# Altium project Freezer_Power.PrjPcb (part 1 of 2)
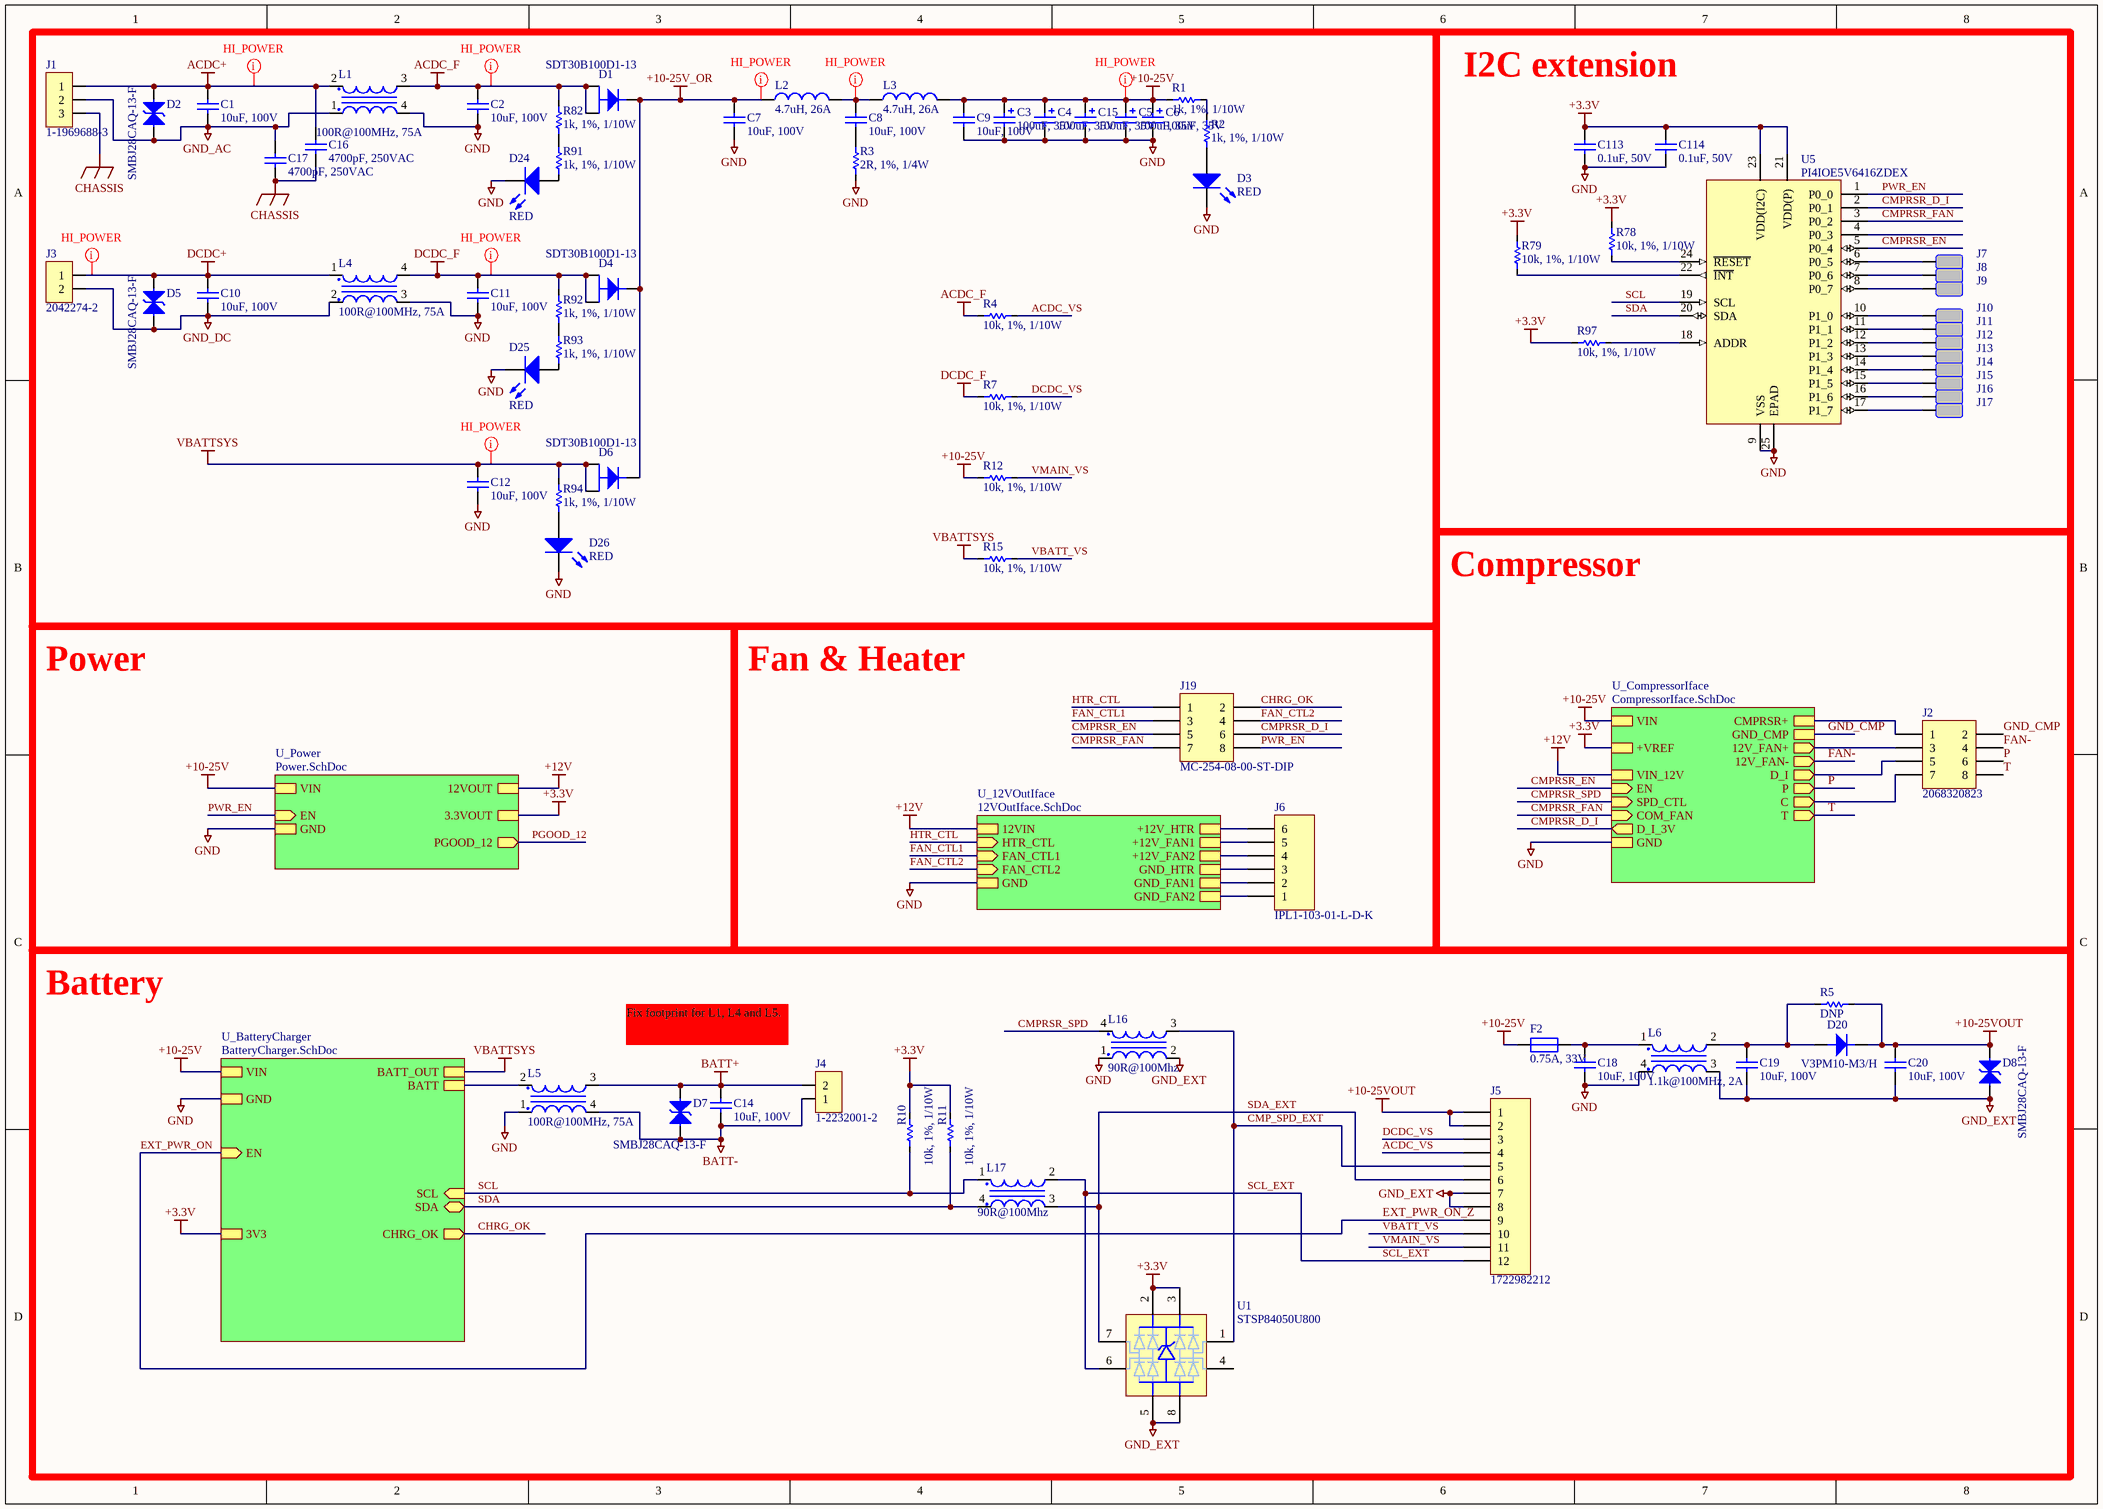
[diagram p0: TopLevel.SchDoc]
BOMRevision: 1.0; ProjectNumber: BIOL-004; ProjectRevision: 1.0; ProjectTitle: Freezer Power
5 sheets, 312 parts. Net scope: hierarchical (ports join the sheet entries above them; power ports are global).
Board file: Freezer_Power.PcbDoc
Sheets:
  TopLevel.SchDoc
    U_BatteryCharger = BatteryCharger.SchDoc
    U_CompressorIface = CompressorIface.SchDoc
    U_Power = Power.SchDoc
    U_12VOutIface = 12VOutIface.SchDoc

## Sheet TopLevel.SchDoc
size A3; SheetNumber: 1; SheetTotal: 5

### Parts
C1  10uF, 100V  [1210]
C2  10uF, 100V  [1210]
C3  100uF, 35V  [CAPAE7866X80L]
C4  100uF, 35V  [CAPAE7866X80L]
C5  100uF, 35V  [CAPAE7866X80L]
C6  100uF, 35V  [CAPAE7866X80L]
C7  10uF, 100V  [1210]
C8  10uF, 100V  [1210]
C9  10uF, 100V  [1210]
C10  10uF, 100V  [1210]
C11  10uF, 100V  [1210]
C12  10uF, 100V  [1210]
C14  10uF, 100V  [1210]
C15  100uF, 35V  [CAPAE7866X80L]
C16  4700pF, 250VAC  [2220-2.5_CAP]
C17  4700pF, 250VAC  [2220-2.5_CAP]
C18  10uF, 100V  [1210]
C19  10uF, 100V  [1210]
C20  10uF, 100V  [1210]
C113  0.1uF, 50V  [0603]
C114  0.1uF, 50V  [0603]
D1  SDT30B100D1-13  [DPAK]
D2  SMBJ28CAQ-13-F  [SMB]
D3  RED  [0603_DIODE_K1A2]
D4  SDT30B100D1-13  [DPAK]
D5  SMBJ28CAQ-13-F  [SMB]
D6  SDT30B100D1-13  [DPAK]
D7  SMBJ28CAQ-13-F  [SMB]
D8  SMBJ28CAQ-13-F  [SMB]
D20  V3PM10-M3/H  [SMP]
D24  RED  [0603_DIODE_K1A2]
D25  RED  [0603_DIODE_K1A2]
D26  RED  [0603_DIODE_K1A2]
F2  0.75A, 33V  [1812_CAP]
J1  1-1969688-3  [CONN_TE_1-1969688-3]
J2  2068320823  [CONN_206832-0823]
J3  2042274-2  [CONN_TE_2042274-2]
J4  1-2232001-2  [CONN_TE_1-2232001-2]
J5  1722982212  [CONN_MOLEX_1722982212]
J6  IPL1-103-01-L-D-K  [CONN_SAMTEC_IPL1-103-XX-X-D]
J7  1.5x3.5  [PAD_15_35]  (value not drawn)  (no BOM)
J8  1.5x3.5  [PAD_15_35]  (value not drawn)  (no BOM)
J9  1.5x3.5  [PAD_15_35]  (value not drawn)  (no BOM)
J10  1.5x3.5  [PAD_15_35]  (value not drawn)  (no BOM)
J11  1.5x3.5  [PAD_15_35]  (value not drawn)  (no BOM)
J12  1.5x3.5  [PAD_15_35]  (value not drawn)  (no BOM)
J13  1.5x3.5  [PAD_15_35]  (value not drawn)  (no BOM)
J14  1.5x3.5  [PAD_15_35]  (value not drawn)  (no BOM)
J15  1.5x3.5  [PAD_15_35]  (value not drawn)  (no BOM)
J16  1.5x3.5  [PAD_15_35]  (value not drawn)  (no BOM)
J17  1.5x3.5  [PAD_15_35]  (value not drawn)  (no BOM)
J19  MC-254-08-00-ST-DIP  [CONN_206832]
L1  100R@100MHz, 75A  [FIL_CM5441Z101B-10]
L2  4.7uH, 26A  [INDM178169X70N]
L3  4.7uH, 26A  [INDM178169X70N]
L4  100R@100MHz, 75A  [FIL_CM5441Z101B-10]
L5  100R@100MHz, 75A  [FIL_CM5441Z101B-10]
L6  1.1k@100MHz, 2A  [PLCC440P435X370X235-4L]
L16  90R@100Mhz  [BOURNS_SRF2012]
L17  90R@100Mhz  [BOURNS_SRF2012]
R1  1k, 1%, 1/10W  [0603]
R2  1k, 1%, 1/10W  [0603]
R3  2R, 1%, 1/4W  [1206]
R4  10k, 1%, 1/10W  [0603]
R5  DNP  [0805]
R7  10k, 1%, 1/10W  [0603]
R10  10k, 1%, 1/10W  [0603]
R11  10k, 1%, 1/10W  [0603]
R12  10k, 1%, 1/10W  [0603]
R15  10k, 1%, 1/10W  [0603]
R78  10k, 1%, 1/10W  [0603]
R79  10k, 1%, 1/10W  [0603]
R82  1k, 1%, 1/10W  [0603]
R91  1k, 1%, 1/10W  [0603]
R92  1k, 1%, 1/10W  [0603]
R93  1k, 1%, 1/10W  [0603]
R94  1k, 1%, 1/10W  [0603]
R97  10k, 1%, 1/10W  [0603]
U1  STSP84050U800  [SOIC127P600X163-8N]
U5  PI4IOE5V6416ZDEX  [QFN50P400X400X90_HS-25L]

### Blocks framed on the sheet
I2C extension: C113 C114 J7-J17 R78 R79 R97 U5
Compressor: J2
Fan & Heater: J6 J19
Battery: C14 C18-C20 D7 D8 D20 F2 J4 J5 L5 L6 L16 L17 R5 R10 R11 U1

### Sub-sheets
U_12VOutIface = 12VOutIface.SchDoc: 12VIN, GND, HTR_CTL (in), FAN_CTL1 (in), FAN_CTL2 (in), +12V_FAN1, +12V_FAN2, +12V_HTR, GND_HTR, GND_FAN2, GND_FAN1
U_BatteryCharger = BatteryCharger.SchDoc: VIN, GND, EN (in), BATT_OUT, BATT, CHRG_OK (out), SCL (in), SDA (bidir), 3V3
U_CompressorIface = CompressorIface.SchDoc: VIN, EN (in), GND, SPD_CTL (in), D_I_3V (out), COM_FAN (in), +VREF, CMPRSR+, 12V_FAN+ (out), 12V_FAN- (out), D_I (out), C (out), P (out), T (out), GND_CMP, VIN_12V
U_Power = Power.SchDoc: EN (in), VIN, GND, 12VOUT, PGOOD_12 (out), 3.3VOUT

### Nets
12V_FAN+: J2.3 ; sheet U_CompressorIface/12V_FAN+
+3.3V: C113.1 C114.1 R10.1 R11.1 R78.1 R79.1 R97.1 U1.2 U1.3 U5.21(VDD(P)) U5.23(VDD(I2C)) ; sheet U_BatteryCharger/3V3, sheet U_CompressorIface/+VREF, sheet U_Power/3.3VOUT
+10-25V: C3.1 C4.1 C5.1 C6.1 C9.2 C15.1 F2.2(K) L3.2 R1.2 R12.2 ; sheet U_BatteryCharger/VIN, sheet U_CompressorIface/VIN, sheet U_Power/VIN
+10-25V_OR: C7.2 D1.2(K) D4.2(K) D6.2(K) L2.1
+10-25VOUT: C20.2 D8.2(K) D20.2(K) J5.1 J5.2 R5.2
+12V: sheet U_CompressorIface/VIN_12V, sheet U_Power/12VOUT, sheet U_12VOutIface/12VIN
+12V_FAN1: J6.5 ; sheet U_12VOutIface/+12V_FAN1
+12V_FAN2: J6.4 ; sheet U_12VOutIface/+12V_FAN2
+12V_HTR: J6.6 ; sheet U_12VOutIface/+12V_HTR
ACDC+: C1.2 C16.2 D2.2(K) J1.1 L1.2
ACDC_F: C2.2 D1.1(A) D1.3(A) L1.3 R4.2 R82.1
BATT+: C14.2 D7.2(K) J4.2 L5.3
BATT-: C14.1 D7.1(A) J4.1 L5.4
CHASSIS: C16.1 C17.1 J1.3
CMPRSR+: J2.1 ; sheet U_CompressorIface/CMPRSR+
DCDC+: C10.2 D5.2(K) J3.1 L4.1
DCDC_F: C11.2 D4.1(A) D4.3(A) L4.4 R7.2 R92.1
FAN-: J2.4 ; sheet U_CompressorIface/12V_FAN-  [project net 12V_FAN-]
GND: C2.1 C3.2 C4.2 C5.2 C6.2 C7.1 C9.1 C11.1 C12.1 C15.2 C18.1 C113.2 C114.2 D3.2(K) D24.2(K) D25.2(K) D26.2(K) L1.4 L4.3 L5.1 L6.4 L16.1 R3.1 U5.9(VSS) U5.25(EPAD) ; sheet U_BatteryCharger/GND, sheet U_CompressorIface/GND, sheet U_Power/GND, sheet U_12VOutIface/GND
GND_AC: C1.1 C17.2 D2.1(A) J1.2 L1.1
GND_CMP: J2.2 ; sheet U_CompressorIface/GND_CMP
GND_DC: C10.1 D5.1(A) J3.2 L4.2
GND_EXT: C19.1 C20.1 D8.1(A) J5.7 J5.8 L6.3 L16.2 U1.5 U1.8
GND_FAN1: J6.2 ; sheet U_12VOutIface/GND_FAN1
GND_FAN2: J6.1 ; sheet U_12VOutIface/GND_FAN2
GND_HTR: J6.3 ; sheet U_12VOutIface/GND_HTR
SR1_N: L5.2 ; sheet U_BatteryCharger/BATT
VBATTSYS: C12.2 D6.1(A) D6.3(A) R15.2 R94.1 ; sheet U_BatteryCharger/BATT_OUT  [project net SR1_P]
ACDC_VS: J5.4 R4.1
C: J2.7 ; sheet U_CompressorIface/C
CHRG_OK: J19.2 ; sheet U_BatteryCharger/CHRG_OK
CMP_SPD_EXT: J5.5 L16.3 U1.1
CMPRSR_D_I: J19.6 U5.2(P0_1) ; sheet U_CompressorIface/D_I_3V
CMPRSR_EN: J19.5 U5.5(P0_4) ; sheet U_CompressorIface/EN
CMPRSR_FAN: J19.7 U5.3(P0_2) ; sheet U_CompressorIface/COM_FAN
CMPRSR_SPD: L16.4 ; sheet U_CompressorIface/SPD_CTL
D_I: J2.5 ; sheet U_CompressorIface/D_I
DCDC_VS: J5.3 R7.1
EXT_PWR_ON: J5.9 ; sheet U_BatteryCharger/EN  [also labelled EXT_PWR_ON_Z]
FAN_CTL1: J19.3 ; sheet U_12VOutIface/FAN_CTL1
FAN_CTL2: J19.4 ; sheet U_12VOutIface/FAN_CTL2
HTR_CTL: J19.1 ; sheet U_12VOutIface/HTR_CTL
P: J2.6 ; sheet U_CompressorIface/P
PWR_EN: J19.8 U5.1(P0_0) ; sheet U_Power/EN  [project net EN]
SCL: L17.1 R10.2 U5.19(SCL) ; sheet U_BatteryCharger/SCL
SCL_EXT: J5.12 L17.2 U1.6
SDA: L17.4 R11.2 U5.20(SDA) ; sheet U_BatteryCharger/SDA
SDA_EXT: J5.6 L17.3 U1.7
T: J2.8 ; sheet U_CompressorIface/T
VBATT_VS: J5.10 R15.1
VMAIN_VS: J5.11 R12.1
NetC8_1: C8.1 R3.2
NetC8_2: C8.2 L2.2 L3.1
NetC18_2: C18.2 F2.1(A) L6.1
NetC19_2: C19.2 D20.1(A) L6.2 R5.1
NetD3_1: D3.1(A) R2.2
NetD24_1: D24.1(A) R91.2
NetD25_1: D25.1(A) R93.2
NetD26_1: D26.1(A) R94.2
NetJ7_1: J7.1 U5.6(P0_5)
NetJ8_1: J8.1 U5.7(P0_6)
NetJ9_1: J9.1 U5.8(P0_7)
NetJ10_1: J10.1 U5.10(P1_0)
NetJ11_1: J11.1 U5.11(P1_1)
NetJ12_1: J12.1 U5.12(P1_2)
NetJ13_1: J13.1 U5.13(P1_3)
NetJ14_1: J14.1 U5.14(P1_4)
NetJ15_1: J15.1 U5.15(P1_5)
NetJ16_1: J16.1 U5.16(P1_6)
NetJ17_1: J17.1 U5.17(P1_7)
NetR1_1: R1.1 R2.1
NetR78_2: R78.2 U5.24(~{RESET})
NetR79_2: R79.2 U5.22(~{INT})
NetR82_2: R82.2 R91.1
NetR92_2: R92.2 R93.1
NetR97_2: R97.2 U5.18(ADDR)

Not connected (* = marked no-connect by the designer): U1 4; U5 4(P0_3)

### Layout directives
net class HI_POWER: +10-25V, +10-25V_OR, ACDC+, ACDC_F, DCDC+, DCDC_F, NetC8_2, SR1_P

### Notes on the sheet
- Power
- Fix footprint for L1, L4 and L5.

### Library data of the parts
C1 C2 C7-C12 C14 C18-C20 = NS00779: MLCC 10UF 100V X7S 1210; Type: C; Alternatives: Generic; Part Number: NS00779; Value: 10uF, 100V; Supplier 1: Digi-Key; Supplier Part Number 1: 1276-CL32Y106KCVZNWECT-ND
C3-C6 C15 = NS00911: CAP ALUM 100UF 20% 35V SMD; Type: C; Alternatives: Generic; Part Number: NS00911; Value: 100uF, 35V; Supplier 1: Digi-Key; Supplier Part Number 1: PCE5051CT-ND
C16 C17 = NS00768: CAP CER 4700PF 250VAC X7R 2220; Type: C; Alternatives: Generic; Part Number: NS00768; Value: 4700pF, 250VAC; Supplier 1: Digi-Key; Supplier Part Number 1: 2873-SCC2220X472K502TGCT-ND
C113 C114 = NS00838: CAP CER 0.1UF 50V X7R 0603; Type: C; Alternatives: Generic; Part Number: NS00838; Value: 0.1uF, 50V; Supplier 1: Digi-Key; Supplier Part Number 1: 1276-1935-1-ND
D1 D4 D6 = NS00785: DIODE SCHOTTKY 100V 30A TO252; Part Number: NS00785; Type: Diode; Value: SDT30B100D1-13; ComponentLink1Description: Datasheet; ComponentLink1URL: H:\Doc\Diodes\SDT30B100D1.pdf; Supplier 1: Digi-Key; Supplier Part Number 1: SDT30B100D1-13DICT-ND
D2 D5 D7 D8 = NS00890: TVS DIODE 28VWM 45.4VC SMB; Part Number: NS00890; Type: Diode; Value: SMBJ28CAQ-13-F; ComponentLink1Description: Datasheet; ComponentLink1URL: H:\Doc\Diodes\SMBJ6.5CAQ-SMBJ100CAQ.pdf; Supplier 1: Digi-Key; Supplier Part Number 1: SMBJ28CAQ-13-FDICT-ND
D3 D24-D26 = NS00945: LED RED CLEAR 1608 SMD; Type: IC; Part Number: NS00945; Value: RED; ComponentLink1Description: Datasheet; ComponentLink1URL: H:\Doc\Harvatek\B1911USD-20D000114U1930.pdf; Supplier 1: Digi-Key; Supplier Part Number 1: 3147-B1911USD-20D000114U1930CT-ND
D20 = NS00857: SCHOTTKY RECTIFIER 3A 100V SMP; Part Number: NS00857; Type: Diode; Value: V3PM10-M3/H; ComponentLink1Description: Datasheet; ComponentLink1URL: H:\Doc\Vishay\v3pm10.pdf; Supplier 1: Digi-Key; Supplier Part Number 1: 112-V3PM10-M3/HCT-ND
F2 = NS00949: PTC RESET FUSE 33V 750MA 1812; Alternatives: Generic; Part Number: NS00949; Type: Fuse; Value: 0.75A, 33V; Supplier 1: Digi-Key; Supplier Part Number 1: 283-3153-1-ND
J1 = NS00900: CONN HEADER VERT 3POS 6MM; Part Number: NS00900; Type: Connector; Value: 1-1969688-3; ComponentLink1Description: Product Spec; ComponentLink1URL: H:\Doc\Tyco\ENG_SS_108-32090_E.pdf; ComponentLink2Description: Application Spec; ComponentLink2URL: H:\Doc\Tyco\ENG_SS_114-32136_D.pdf; ComponentLink3Description: Drawing; ComponentLink3URL: H:\Doc\Tyco\ENG_CD_1969688_C.pdf; Supplier 1: Digi-Key; Supplier Part Number 1: A120938-ND
J2 = Header 4X2: Connector Header Through Hole 8 position 0.118" (3.00mm); LatestRevisionDate: 17-Jul-2002; LatestRevisionNote: Re-released for DXP Platform.; Publisher: Altium Limited; Supplier 1: Digi-Key; Supplier Part Number 1: WM10684-ND
J3 = NS00791: CONN HEADER 2POS PCB; Part Number: NS00791; Type: Connector; Value: 2042274-2; ComponentLink1Description: Datasheet; ComponentLink1URL: H:\Doc\Tyco\ENG_SS_108-19346_H1.pdf; ComponentLink2Description: Drawing; ComponentLink2URL: H:\Doc\Tyco\ENG_CD_2042274_D.pdf; ComponentLink3Description: Application Specification; ComponentLink3URL: H:\Doc\Tyco\ENG_SS_114-19110_C.pdf; Supplier 1: Digi-Key; Supplier Part Number 1: A105511CT-ND
J4 = NS00788: CONN HEADER VERT 2POS 5MM; Part Number: NS00788; Type: Connector; Value: 1-2232001-2; ComponentLink1Description: Datasheet; ComponentLink1URL: H:\Doc\Tyco\ENG_CD_1971845_B1.pdf; Supplier 1: Digi-Key; Supplier Part Number 1: A117216-ND
J5 = NS00894: CONN HEADER VERT 12POS 3.5MM; Part Number: NS00894; Type: Connector; Value: 1722982212; ComponentLink1Description: Datasheet; ComponentLink1URL: H:\Doc\Molex\1722982212_PCB_HEADERS.pdf; ComponentLink2Description: Application Specification; ComponentLink2URL: H:\Doc\Molex\AS-172323-0001-001.pdf; ComponentLink3Description: Drawing; ComponentLink3URL: H:\Doc\Molex\1722982212_sd.pdf; Supplier 1: Digi-Key; Supplier Part Number 1: WM11767-ND
J6 = NS00897: CONN HEADER VERT 6POS 2.54MM; Part Number: NS00897; Type: Connector; Value: IPL1-103-01-L-D-K; ComponentLink1Description: Datasheet; ComponentLink1URL: H:\Doc\Samtec\100_mini_mate.pdf; ComponentLink2Description: Dimensions; ComponentLink2URL: H:\Doc\Samtec\ipl1.pdf; Supplier 1: Digi-Key; Supplier Part Number 1: SAM9594-ND
J7-J17 = NS00465: PAD SOLDER 1.5x3.5MM; Part Number: NS00465; Type: Mechanical; Value: 1.5x3.5
J19 = Header 4X2: Header, 4-Pin, Dual row; LatestRevisionDate: 17-Jul-2002; LatestRevisionNote: Re-released for DXP Platform.; Publisher: Altium Limited; Supplier 1: Farnell; Supplier Part Number 1: MC-254-08-00-ST-DIP
L1 L4 L5 = NS00942: CMC 75A 2LN 100 OHM TH; Type: Inductor; Part Number: NS00942; Value: 100R@100MHz, 75A; ComponentLink1Description: Datasheet; ComponentLink1URL: H:\Doc\Laird\cm5441z101b-10-datasheet.pdf; Supplier 1: Digi-Key; Supplier Part Number 1: 240-2489-ND
L2 L3 = NS00854: FIXED IND 4.7UH 26A 5.5 MOHM SMD; Part Number: NS00854; Type: Inductor; Value: 4.7uH, 26A; ComponentLink1Description: Datasheet; ComponentLink1URL: H:\Doc\Bourns\srp1770c.pdf; Supplier 1: Digi-Key; Supplier Part Number 1: SRP1770C-4R7MCT-ND
L6 = CHOKE_COMMON_ALT: CMC 2A 2LN 1.1K OHM SMD; Part Number: NS00952; Type: Inductor; Value: 1.1k@100MHz, 2A; ComponentLink1Description: Datasheet; ComponentLink1URL: H:\Doc\Murata\EFLC0026.pdf; Supplier 1: Digi-Key; Supplier Part Number 1: 490-12641-1-ND
L16 L17 = NS00042: INDUCTOR COMMON MODE 90 OHM 25%; Part Number: NS00042; Type: Inductor; Value: 90R@100Mhz; ComponentLink1Description: Datasheet; ComponentLink1URL: H:\Doc\Bourns\SRF2012A.pdf; Supplier 1: Digi-Key; Supplier Part Number 1: SRF2012-900YATR-ND
R1 R2 R82 R91-R94 = NS00882: RES 1K OHM 1% 1/10W 0603; Alternatives: Generic; Part Number: NS00882; Type: R; Value: 1k, 1%, 1/10W; Supplier 1: Digi-Key; Supplier Part Number 1: RMCF0603FT1K00CT-ND
R3 = NS00946: RES 2 OHM 1% 1/4W 1206; Alternatives: Generic; Part Number: NS00946; Type: R; Value: 2R, 1%, 1/4W; Supplier 1: Digi-Key; Supplier Part Number 1: 738-RMCF1206FT2R00CT-ND
R4 R7 R10-R12 R15 R78 R79 R97 = NS00820: RES 10K OHM 1% 1/10W 0603; Alternatives: Generic; Part Number: NS00820; Type: R; Value: 10k, 1%, 1/10W; Supplier 1: Digi-Key; Supplier Part Number 1: RMCF0603FT10K0CT-ND
R5 = NS00258: RES SMD 0.0 OHM JUMPER 1/2W 0805; Value: 0R; Part Number: NS00258; Type: R; Supplier 1: Digi-Key; Supplier Part Number 1: 36-5106CT-ND
U1 = NS00913: TVS DIODE 5VWM 20VC 8-SOP; Part Number: NS00913; Type: IC; Value: STSP84050U800; ComponentLink1Description: Datasheet; ComponentLink1URL: H:\Doc\Eaton\eaton-stsp84xxxxxx-tvs-diode-array-esd-suppressor-data-sheet.pdf; Supplier 1: Digi-Key; Supplier Part Number 1: 283-STSP84050U800CT-ND
U5 = NS00947: IC XPNDR 400KHZ I2C 24TQFN; Part Number: NS00947; Type: IC; Value: PI4IOE5V6416ZDEX; ComponentLink1Description: Datasheet; ComponentLink1URL: H:\Doc\Diodes\PI4IOE5V6416.pdf; Supplier 1: Digi-Key; Supplier Part Number 1: PI4IOE5V6416ZDEXDICT-ND

## Sheet BatteryCharger.SchDoc
size A3; SheetNumber: 2; SheetTotal: 5
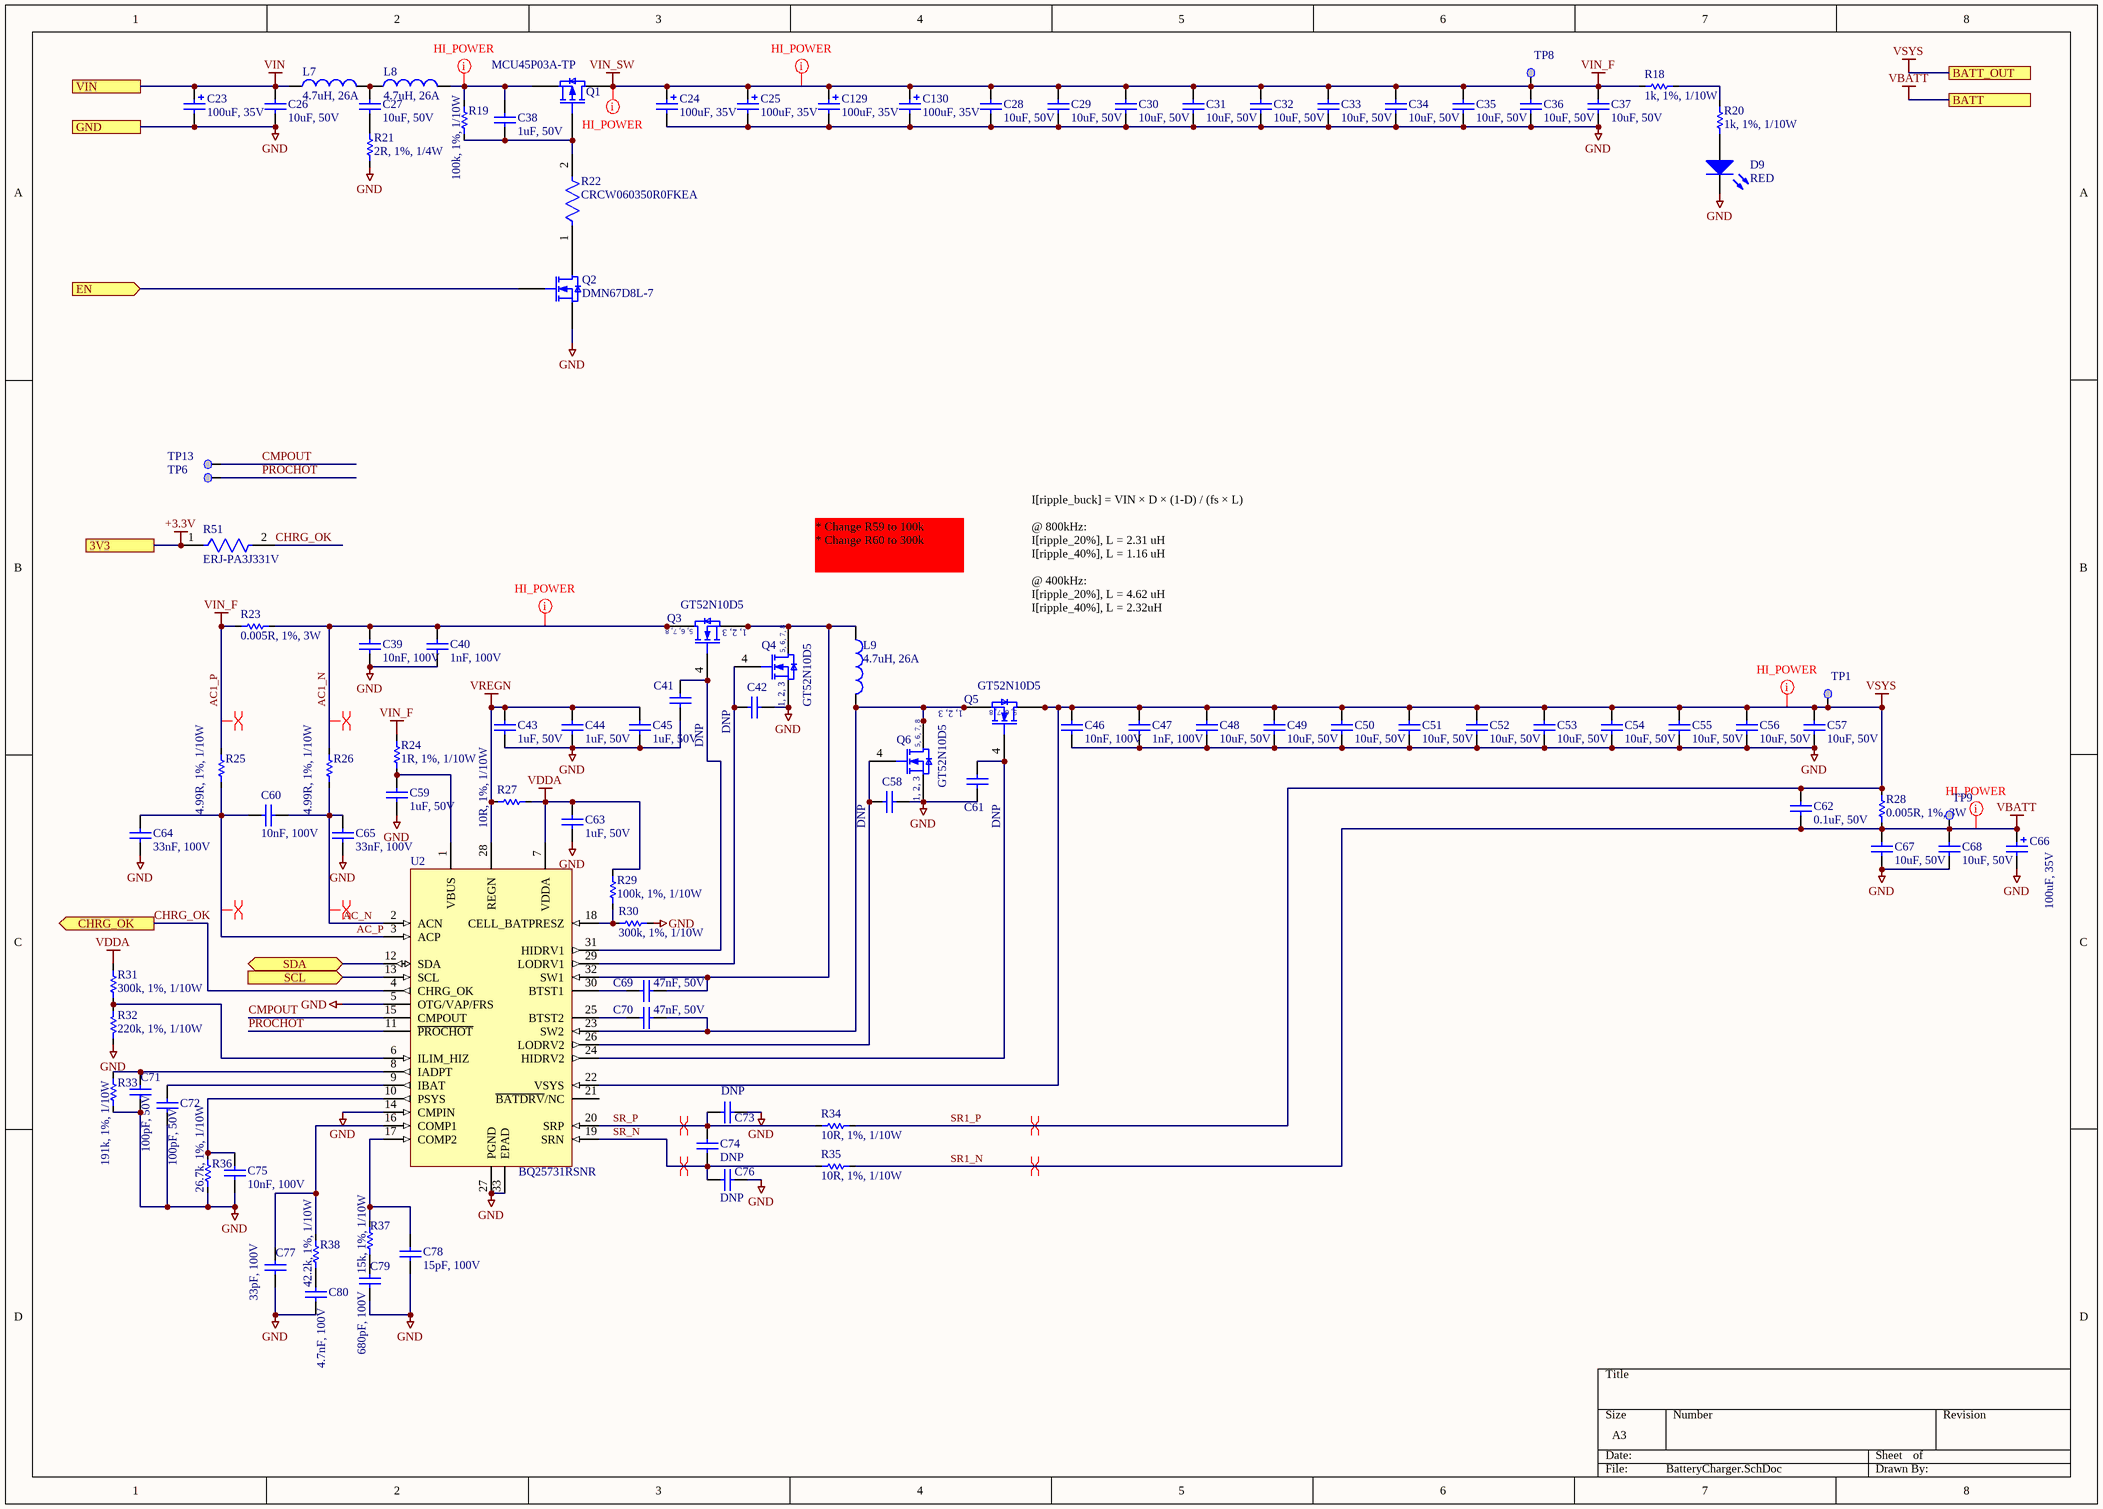
[diagram p1: BatteryCharger.SchDoc]

### Parts
C23  100uF, 35V  [CAPAE7866X80L]
C24  100uF, 35V  [CAPAE7866X80L]
C25  100uF, 35V  [CAPAE7866X80L]
C26  10uF, 50V  [1206]
C27  10uF, 50V  [1206]
C28  10uF, 50V  [1206]
C29  10uF, 50V  [1206]
C30  10uF, 50V  [1206]
C31  10uF, 50V  [1206]
C32  10uF, 50V  [1206]
C33  10uF, 50V  [1206]
C34  10uF, 50V  [1206]
C35  10uF, 50V  [1206]
C36  10uF, 50V  [1206]
C37  10uF, 50V  [1206]
C38  1uF, 50V  [0805]
C39  10nF, 100V  [0603]
C40  1nF, 100V  [0603]
C41  DNP  [0603]
C42  DNP  [0603]
C43  1uF, 50V  [0805]
C44  1uF, 50V  [0805]
C45  1uF, 50V  [0805]
C46  10nF, 100V  [0603]
C47  1nF, 100V  [0603]
C48  10uF, 50V  [1206]
C49  10uF, 50V  [1206]
C50  10uF, 50V  [1206]
C51  10uF, 50V  [1206]
C52  10uF, 50V  [1206]
C53  10uF, 50V  [1206]
C54  10uF, 50V  [1206]
C55  10uF, 50V  [1206]
C56  10uF, 50V  [1206]
C57  10uF, 50V  [1206]
C58  DNP  [0603]
C59  1uF, 50V  [0805]
C60  10nF, 100V  [0603]
C61  DNP  [0603]
C62  0.1uF, 50V  [0603]
C63  1uF, 50V  [0805]
C64  33nF, 100V  [0805_CAP]
C65  33nF, 100V  [0805_CAP]
C66  100uF, 35V  [CAPAE7866X80L]
C67  10uF, 50V  [1206]
C68  10uF, 50V  [1206]
C69  47nF, 50V  [0603]
C70  47nF, 50V  [0603]
C71  100pF, 50V  [0603]
C72  100pF, 50V  [0603]
C73  DNP  [0603]
C74  DNP  [0603]
C75  10nF, 100V  [0603]
C76  DNP  [0603]
C77  33pF, 100V  [0603]
C78  15pF, 100V  [0603]
C79  680pF, 100V  [0603]
C80  4.7nF, 100V  [0603]
C129  100uF, 35V  [CAPAE7866X80L]
C130  100uF, 35V  [CAPAE7866X80L]
D9  RED  [0603_DIODE_K1A2]
L7  4.7uH, 26A  [INDM178169X70N]
L8  4.7uH, 26A  [INDM178169X70N]
L9  4.7uH, 26A  [INDM178169X70N]
Q1  MCU45P03A-TP  [DPAK]
Q2  DMN67D8L-7  [SOT23-3]
Q3  GT52N10D5  [8-PowerSMD]
Q4  GT52N10D5  [8-PowerSMD]
Q5  GT52N10D5  [8-PowerSMD]
Q6  GT52N10D5  [8-PowerSMD]
R18  1k, 1%, 1/10W  [0603]
R19  100k, 1%, 1/10W  [0603]
R20  1k, 1%, 1/10W  [0603]
R21  2R, 1%, 1/4W  [1206]
R22  CRCW060350R0FKEA  [FP-CRCW0603-e3-IPC_A]
R23  0.005R, 1%, 3W  [2512_RES_1]
R24  1R, 1%, 1/10W  [0603]
R25  4.99R, 1%, 1/10W  [0603]
R26  4.99R, 1%, 1/10W  [0603]
R27  10R, 1%, 1/10W  [0603]
R28  0.005R, 1%, 3W  [2512_RES_1]
R29  100k, 1%, 1/10W  [0603]
R30  300k, 1%, 1/10W  [0603]
R31  300k, 1%, 1/10W  [0603]
R32  220k, 1%, 1/10W  [0603]
R33  191k, 1%, 1/10W  [0603]
R34  10R, 1%, 1/10W  [0603]
R35  10R, 1%, 1/10W  [0603]
R36  26.7k, 1%, 1/10W  [0603]
R37  15k, 1%, 1/10W  [0603]
R38  42.2k, 1%, 1/10W  [0603]
R51  ERJ-PA3J331V  [FP-ERJPA3-MFG]
TP1  Test Point  [TEST POINT 40 Mil]  (value not drawn)  (no BOM)
TP6  Test Point  [TEST POINT 40 Mil]  (value not drawn)  (no BOM)
TP8  Test Point  [TEST POINT 40 Mil]  (value not drawn)  (no BOM)
TP9  Test Point  [TEST POINT 40 Mil]  (value not drawn)  (no BOM)
TP13  Test Point  [TEST POINT 40 Mil]  (value not drawn)  (no BOM)
U2  BQ25731RSNR  [QFN40P400X400X80_HS-33L]

### Ports
3V3, BATT, BATT_OUT, CHRG_OK (out), EN (in), GND, SCL (in), SDA (bidir), VIN

### Nets
+3.3V: R51.1 ; port 3V3
AC1_P: C24.1 C25.1 C28.2 C29.2 C30.2 C31.2 C32.2 C33.2 C34.2 C35.2 C36.2 C37.2 C129.1 C130.1 Q1.2(D) R18.2 R23.1 R24.2 R25.2 TP8.1  [also labelled VIN_F, VIN_SW]
GND: C23.2 C24.2 C25.2 C26.1 C28.1 C29.1 C30.1 C31.1 C32.1 C33.1 C34.1 C35.1 C36.1 C37.1 C39.1 C40.1 C41.2 C42.2 C43.1 C44.1 C45.1 C46.1 C47.1 C48.1 C49.1 C50.1 C51.1 C52.1 C53.1 C54.1 C55.1 C56.1 C57.1 C58.2 C59.1 C61.2 C63.1 C64.1 C65.1 C66.2 C67.1 C68.1 C71.2 C72.1 C73.2 C75.1 C76.2 C77.1 C78.1 C79.1 C80.1 C129.2 C130.2 D9.2(K) Q2.2(S) Q4.1(S1) Q4.2(S2) Q4.3(S3) Q6.1(S1) Q6.2(S2) Q6.3(S3) R21.1 R30.1 R32.2 R33.1 R36.1 U2.5(OTG/VAP/FRS) U2.14(CMPIN) U2.27(PGND) U2.33(EPAD) ; port GND
SR1_N: C62.1 C66.1 C67.2 C68.2 R28.1 R35.2 TP9.1 ; port BATT  [also labelled VBATT]
SR1_P: C46.2 C47.2 C48.2 C49.2 C50.2 C51.2 C52.2 C53.2 C54.2 C55.2 C56.2 C57.2 C62.2 Q5.5(D1) Q5.6(D2) Q5.7(D3) Q5.8(D4) R28.2 R34.2 TP1.1 U2.22(VSYS) ; port BATT_OUT  [also labelled VSYS]
VDDA: C63.2 R27.2 R29.2 R31.2 U2.7(VDDA)
VIN: C23.1 C26.2 L7.1 ; port VIN  [project net +10-25V]
VREGN: C43.2 C44.2 C45.2 R27.1 U2.28(REGN)
AC1_N: C39.2 C40.2 Q3.5(D1) Q3.6(D2) Q3.7(D3) Q3.8(D4) R23.2 R26.2
AC_N: C60.1 C65.2 R26.1 U2.2(ACN)
AC_P: C60.2 C64.2 R25.1 U2.3(ACP)
CHRG_OK: R51.2 U2.4(CHRG_OK) ; port CHRG_OK
CMPOUT: TP13.1 U2.15(CMPOUT)
EXT_PWR_ON: Q2.1(G) ; port EN
PROCHOT: TP6.1 U2.11(~{PROCHOT})
SCL: U2.13(SCL) ; port SCL
SDA: U2.12(SDA) ; port SDA
SR_N: C74.1 C76.1 R35.1 U2.19(SRN)
SR_P: C73.1 C74.2 R34.1 U2.20(SRP)
NetC27_1: C27.1 R21.2
NetC27_2: C27.2 L7.2 L8.1
NetC38_1: C38.1 Q1.1(G) R19.1 R22.2
NetC38_2: C38.2 L8.2 Q1.3(S) R19.2
NetC41_1: C41.1 Q3.4(G) U2.31(HIDRV1)
NetC42_1: C42.1 Q4.4(G) U2.29(LODRV1)
NetC58_1: C58.1 Q6.4(G) U2.26(LODRV2)
NetC59_2: C59.2 R24.1 U2.1(VBUS)
NetC61_1: C61.1 Q5.4(G) U2.24(HIDRV2)
NetC69_1: C69.1 L9.1 Q3.1(S1) Q3.2(S2) Q3.3(S3) Q4.5(D1) Q4.6(D2) Q4.7(D3) Q4.8(D4) U2.32(SW1)
NetC69_2: C69.2 U2.30(BTST1)
NetC70_1: C70.1 L9.2 Q5.1(S1) Q5.2(S2) Q5.3(S3) Q6.5(D1) Q6.6(D2) Q6.7(D3) Q6.8(D4) U2.23(SW2)
NetC70_2: C70.2 U2.25(BTST2)
NetC71_1: C71.1 R33.2 U2.8(IADPT)
NetC72_2: C72.2 U2.9(IBAT)
NetC75_2: C75.2 R36.2 U2.10(PSYS)
NetC77_2: C77.2 R38.2 U2.16(COMP1)
NetC78_2: C78.2 R37.2 U2.17(COMP2)
NetC79_2: C79.2 R37.1
NetC80_2: C80.2 R38.1
NetD9_1: D9.1(A) R20.2
NetQ2_3: Q2.3(D) R22.1
NetR18_1: R18.1 R20.1
NetR29_1: R29.1 R30.2 U2.18(CELL_BATPRESZ)
NetR31_1: R31.1 R32.1 U2.6(ILIM_HIZ)

Not connected (* = marked no-connect by the designer): U2 21(~{BATDRV}/NC)

### Layout directives
differential pair: AC1_N, AC1_P, AC_N, AC_P, SR1_N, SR1_P, SR_N, SR_P
net class HI_POWER: AC1_N, AC1_P, NetC38_2, SR1_N, SR1_P

### Notes on the sheet
- * Change R59 to 100k
  * Change R60 to 300k
- I[ripple_buck] = VIN × D × (1-D) / (fs × L)
  @ 800kHz:
  I[ripple_20%], L = 2.31 uH
  I[ripple_40%], L = 1.16 uH
  @ 400kHz:
  I[ripple_20%], L = 4.62 uH
  I[ripple_40%], L = 2.32uH
- (in symbol NS00856) 5, 6, 7, 8; 1, 2, 3

### Library data of the parts
C23-C25 C66 C129 C130 = NS00911: as C3 on sheet TopLevel; Part Number: NS00911; Value: 100uF, 35V; Supplier 1: Digi-Key; Supplier Part Number 1: PCE5051CT-ND
C26-C37 C48-C57 C67 C68 = NS00832: CAP CER 10UF 50V X7R 1206; Type: C; Alternatives: Generic; Part Number: NS00832; Value: 10uF, 50V; Supplier 1: Digi-Key; Supplier Part Number 1: 1276-6767-1-ND
C38 C43-C45 C59 C63 = NS00871: CAP CER 1UF 50V X7R 0805; Type: C; Alternatives: Generic; Part Number: NS00871; Value: 1uF, 50V; Supplier 1: Digi-Key; Supplier Part Number 1: 1276-6470-1-ND
C39 C46 C60 C75 = NS00848: CAP CER 10000PF 100V C0G 0603; Type: C; Alternatives: Generic; Part Number: NS00848; Value: 10nF, 100V; Supplier 1: Digi-Key; Supplier Part Number 1: 445-172665-1-ND
C40 C47 = NS00847: CAP CER 1000PF 100V C0G/NP0 0603; Type: C; Alternatives: Generic; Part Number: NS00847; Value: 1nF, 100V; Supplier 1: Digi-Key; Supplier Part Number 1: 732-12187-1-ND
C41 C42 C58 C61 = NS00840: CAP CER 100PF 50V C0G/NP0 0603; Type: C; Value: 100pF, 50V; Alternatives: Generic; Part Number: NS00840; Supplier 1: Digi-Key; Supplier Part Number 1: 478-1175-1-ND
C62 = NS00838: as C113 on sheet TopLevel; Part Number: NS00838; Value: 0.1uF, 50V; Supplier 1: Digi-Key; Supplier Part Number 1: 1276-1935-1-ND
C64 C65 = NS00800: CAP CER 0.033UF 100V C0G 0805; Type: C; Alternatives: Generic; Part Number: NS00800; Value: 33nF, 100V; Supplier 1: Digi-Key; Supplier Part Number 1: 445-172691-1-ND
C69 C70 = NS00804: CAP CER 0.047UF 50V X7R 0603; Type: C; Alternatives: Generic; Part Number: NS00804; Value: 47nF, 50V; Supplier 1: Digi-Key; Supplier Part Number 1: 1276-1063-1-ND
C71 C72 = NS00840: CAP CER 100PF 50V C0G/NP0 0603; Type: C; Alternatives: Generic; Part Number: NS00840; Value: 100pF, 50V; Supplier 1: Digi-Key; Supplier Part Number 1: 478-1175-1-ND
C73 C74 C76 = NS00895: CAP CER 0.068UF 50V X7R 0603; Type: C; Value: 68nF, 50V; Alternatives: Generic; Part Number: NS00895; Supplier 1: Digi-Key; Supplier Part Number 1: 1276-6541-1-ND
C77 = NS00931: CAP CER 33PF 100V C0G/NP0 0603; Type: C; Alternatives: Generic; Part Number: NS00931; Value: 33pF, 100V; Supplier 1: Digi-Key; Supplier Part Number 1: 399-15919-1-ND
C78 = NS00932: CAP CER 15PF 100V C0G/NP0 0603; Type: C; Alternatives: Generic; Part Number: NS00932; Value: 15pF, 100V; Supplier 1: Digi-Key; Supplier Part Number 1: 1276-CL10C150JC81PNCCT-ND
C79 = NS00933: CAP CER 680PF 100V C0G 0603; Type: C; Alternatives: Generic; Part Number: NS00933; Value: 680pF, 100V; Supplier 1: Digi-Key; Supplier Part Number 1: 445-5734-1-ND
C80 = NS00930: CAP CER 4700PF 100V C0G 0603; Type: C; Alternatives: Generic; Part Number: NS00930; Value: 4.7nF, 100V; Supplier 1: Digi-Key; Supplier Part Number 1: 445-172684-1-ND
D9 = NS00945: LED RED CLEAR 1608 SMD; Type: IC; Part Number: NS00945; Value: RED; ComponentLink1Description: Datasheet; ComponentLink1URL: H:\Doc\Harvatek\B1911USD-20D000114U1930.pdf; Supplier 1: Digi-Key; Supplier Part Number 1: 3147-B1911USD-20D000114U1930CT-ND
L7-L9 = NS00854: FIXED IND 4.7UH 26A 5.5 MOHM SMD; Part Number: NS00854; Type: Inductor; Value: 4.7uH, 26A; ComponentLink1Description: Datasheet; ComponentLink1URL: H:\Doc\Bourns\srp1770c.pdf; Supplier 1: Digi-Key; Supplier Part Number 1: SRP1770C-4R7MCT-ND
Q1 = NS00810: P-CHANNEL MOSFET, DPAK; Type: IC; Part Number: NS00810; Value: MCU45P03A-TP; ComponentLink1Description: Datasheet; ComponentLink1URL: H:\Doc\MicroCommercial\MCU45P03A(DPAK).pdf; Supplier 1: Digi-Key; Supplier Part Number 1: 353-MCU45P03A-TPCT-ND
Q2 = NS00873: MOSFET N-CH 60V 210MA SOT23; Type: IC; Published: 8-Jun-2000; LatestRevisionDate: 17-Jul-2002; LatestRevisionNote: Re-released for DXP Platform.; PackageVersion: 1995/1996; PackageReference: E3; Publisher: Altium Limited; Part Number: NS00873; Value: DMN67D8L-7; ComponentLink1Description: Datasheet; ComponentLink1URL: H:\Doc\Diodes\DMN67D8L.pdf; Supplier 1: Digi-Key; Supplier Part Number 1: DMN67D8L-7DICT-ND
Q3-Q6 = NS00856: N-CH MOSFET 100V 71A 8-PowerTDFN; Type: IC; Published: 8-Jun-2000; LatestRevisionDate: 17-Jul-2002; LatestRevisionNote: Re-released for DXP Platform.; PackageVersion: 1995/1996; PackageReference: E3; Publisher: Altium Limited; Part Number: NS00856; Value: GT52N10D5; ComponentLink1Description: Datasheet; ComponentLink1URL: H:\Doc\Goford\GOFORD GT52N10D5.pdf; Supplier 1: Digi-Key; Supplier Part Number 1: 3141-GT52N10D5CT-ND
R18 R20 = NS00882: as R1 on sheet TopLevel; Part Number: NS00882; Type: R; Value: 1k, 1%, 1/10W; Supplier 1: Digi-Key; Supplier Part Number 1: RMCF0603FT1K00CT-ND
R19 R29 = NS00835: RES 100K OHM 1% 1/10W 0603; Alternatives: Generic; Part Number: NS00835; Type: R; Value: 100k, 1%, 1/10W; Supplier 1: Digi-Key; Supplier Part Number 1: RMCF0603FT100KCT-ND
R21 = NS00946: as R3 on sheet TopLevel; Part Number: NS00946; Type: R; Value: 2R, 1%, 1/4W; Supplier 1: Digi-Key; Supplier Part Number 1: 738-RMCF1206FT2R00CT-ND
R22 = CMP-2000-03436-2: RES Thick Film, 50Ω, 1%, 0.1W, 100ppm/°C, 0603; Voltage Rating (DC): 75V; Resistance: 50R; Power Rating: 100mW; Case/Package: 0603; Packaging: Tape and Reel; Military Standard: Not; REACH SVHC: No SVHC; Width: 0.85mm; Max Operating Temperature: 155°C; Case Code (Metric): 1608; Temperature Coefficient: 100ppm/°C; Lead Free: Lead Free; Height: 0.45mm; Composition: Thick Film; Termination: SMD/SMT; Contact Plating: Tin; Number of Pins: 2; Tolerance: 1%; Depth: 0.85mm; Weight: 7.1E-05oz; Min Operating Temperature: -55°C; Length: 1.55mm; Radiation Hardening: No; Voltage Rating: 75V; Case Code (Imperial): 0603; Package Quantity: 5000; Mount: Surface Mount
R23 R28 = NS00798: RES 0.005 OHM 1% 3W 2512; Alternatives: Generic; Part Number: NS00798; Type: R; Value: 0.005R, 1%, 3W; Supplier 1: Digi-Key; Supplier Part Number 1: CRE2512-FZ-R005E-3CT-ND
R24 = NS00811: RES 1 OHM 1% 1/10W 0603; Alternatives: Generic; Part Number: NS00811; Type: R; Value: 1R, 1%, 1/10W; Supplier 1: Digi-Key; Supplier Part Number 1: RMCF0603FT1R00CT-ND
R25 R26 = NS00799: RES 4.99 OHM 1% 1/10W 0603; Alternatives: Generic; Part Number: NS00799; Type: R; Value: 4.99R, 1%, 1/10W; Supplier 1: Digi-Key; Supplier Part Number 1: RMCF0603FT4R99CT-ND
R27 R34 R35 = NS00796: RES 10 OHM 1% 1/10W 0603; Alternatives: Generic; Part Number: NS00796; Type: R; Value: 10R, 1%, 1/10W; Supplier 1: Digi-Key; Supplier Part Number 1: 1292-WR06X10R0FTLCT-ND
R30 R31 = NS00837: RES 300K OHM 1% 1/10W 0603; Alternatives: Generic; Part Number: NS00837; Type: R; Value: 300k, 1%, 1/10W; Supplier 1: Digi-Key; Supplier Part Number 1: RMCF0603FT300KCT-ND
R32 = NS00915: RES SMD 220K OHM 1% 1/10W 0603; Alternatives: Generic; Part Number: NS00915; Type: R; Value: 220k, 1%, 1/10W; Supplier 1: Digi-Key; Supplier Part Number 1: YAG3579CT-ND
R33 = NS00821: RES 191K OHM 1% 1/10W 0603; Alternatives: Generic; Part Number: NS00821; Type: R; Value: 191k, 1%, 1/10W; Supplier 1: Digi-Key; Supplier Part Number 1: RMCF0603FT191KCT-ND
R36 = NS00823: RES 26.7K OHM 1% 1/10W 0603; Alternatives: Generic; Part Number: NS00823; Type: R; Value: 26.7k, 1%, 1/10W; Supplier 1: Digi-Key; Supplier Part Number 1: RMCF0603FT26K7
R37 = NS00834: RES 15K OHM 1% 1/10W 0603; Alternatives: Generic; Part Number: NS00834; Type: R; Value: 15k, 1%, 1/10W; Supplier 1: Digi-Key; Supplier Part Number 1: 1292-WR06X1502FTLCT-ND
R38 = NS00822: RES 42.2K OHM 1% 1/10W 0603; Alternatives: Generic; Part Number: NS00822; Type: R; Value: 42.2k, 1%, 1/10W; Supplier 1: Digi-Key; Supplier Part Number 1: RMCF0603FT42K2
R51 = CMP-05422-000096-1: RES SMD 330 OHM 5% 1/4W 0603; Resistance: 330R; Temperature Coefficient: 200ppm/°C; Max Power Dissipation: 250mW; Case Code (Imperial): 0603; Height: 0.018inch; Case/Package: 0603; Case Code (Metric): 1608; Width: 0.031inch; Length: 0.063inch; Tolerance: 5%; Features: Automotive AEC-Q200; Min Operating Temperature: -55°C; Max Operating Temperature: 155°C; Resistor Type: Thick Film; Packaging: Cut Tape; Number of Terminations: 2; Parameter 1: *; Parameter 2: *
TP1 TP6 TP8 TP9 TP13 = Test Point: Test Point 0.3mm; PartType: Mechanical; ComponentLink1Description: Datasheet
U2 = NS00795: I2C 1-5 CELL NVDC BUCK-BOOST BAT; Part Number: NS00795; Type: IC; Value: BQ25731RSNR; ComponentLink1Description: Datasheet; ComponentLink1URL: H:\Doc\TI\bq25731.pdf; ComponentLink2Description: Application Notes; ComponentLink2URL: H:\Doc\TI\sluucb9a.pdf; Supplier 1: Digi-Key; Supplier Part Number 1: 296-BQ25731RSNRCT-ND

## Sheet CompressorIface.SchDoc
size A; SheetNumber: 3; SheetTotal: 5
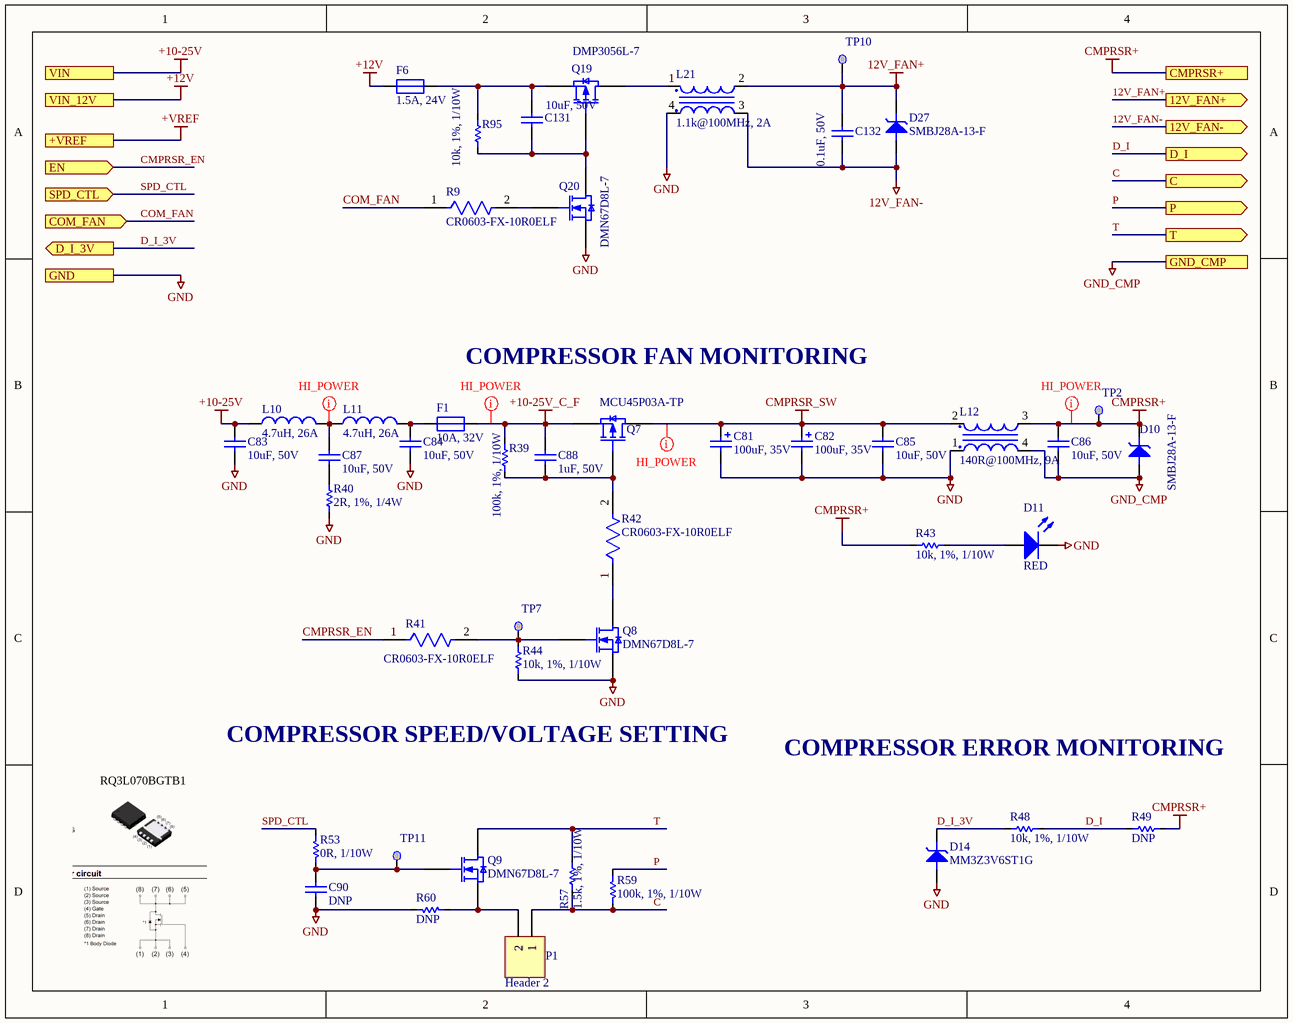
[diagram p2: CompressorIface.SchDoc]

### Parts
C81  100uF, 35V  [CAPAE7866X80L]
C82  100uF, 35V  [CAPAE7866X80L]
C83  10uF, 50V  [1206]
C84  10uF, 50V  [1206]
C85  10uF, 50V  [1206]
C86  10uF, 50V  [1206]
C87  10uF, 50V  [1206]
C88  1uF, 50V  [0805]
C90  DNP  [0805]
C131  10uF, 50V  [1206]
C132  0.1uF, 50V  [0603]
D10  SMBJ28A-13-F  [SMB]
D11  RED  [0603_DIODE_K1A2]
D14  MM3Z3V6ST1G  [SOD323]
D27  SMBJ28A-13-F  [SMB]
F1  10A, 32V  [RAD_TH_1.3DIAx10.2Px27.9H]
F6  1.5A, 24V  [1812_CAP]
L10  4.7uH, 26A  [INDM178169X70N]
L11  4.7uH, 26A  [INDM178169X70N]
L12  140R@100MHz, 9A  [CHOKE_SMD_7.0X6.0X3.8]
L21  1.1k@100MHz, 2A  [PLCC440P435X370X235-4L]
P1  Header 2  [HDR1X2]
Q7  MCU45P03A-TP  [DPAK]
Q8  DMN67D8L-7  [SOT23-3]
Q9  DMN67D8L-7  [SOT23-3]
Q19  DMP3056L-7  [SOT23-3]
Q20  DMN67D8L-7  [SOT23-3]
R9  CR0603-FX-10R0ELF  [FP-CR0603-MFG]
R39  100k, 1%, 1/10W  [0603]
R40  2R, 1%, 1/4W  [1206]
R41  CR0603-FX-10R0ELF  [FP-CR0603-MFG]
R42  CR0603-FX-10R0ELF  [FP-CR0603-MFG]
R43  10k, 1%, 1/10W  [0603]
R44  10k, 1%, 1/10W  [0603]
R48  10k, 1%, 1/10W  [0603]
R49  DNP  [0603]
R53  0R, 1/10W  [0603]
R57  1.5k, 1%, 1/10W  [0603]
R59  100k, 1%, 1/10W  [0603]
R60  DNP  [0603]
R95  10k, 1%, 1/10W  [0603]
TP2  Test Point  [TEST POINT 40 Mil]  (value not drawn)  (no BOM)
TP7  Test Point  [TEST POINT 40 Mil]  (value not drawn)  (no BOM)
TP10  Test Point  [TEST POINT 40 Mil]  (value not drawn)  (no BOM)
TP11  Test Point  [TEST POINT 40 Mil]  (value not drawn)  (no BOM)

### Ports
12V_FAN+ (out), 12V_FAN- (out), +VREF, C (out), CMPRSR+, COM_FAN (in), D_I (out), D_I_3V (out), EN (in), GND, GND_CMP, P (out), SPD_CTL (in), T (out), VIN, VIN_12V

### Nets
12V_FAN+: C132.2 D27.2(K) L21.2 TP10.1 ; port 12V_FAN+
12V_FAN-: C132.1 D27.1(A) L21.3 ; port 12V_FAN-
+10-25V: C83.2 L10.1 ; port VIN
+10-25V_C_F: C88.2 F1.1(A) Q7.3(S) R39.2
+12V: F6.2(K) ; port VIN_12V
CMPRSR+: C86.2 D10.2(K) L12.3 R43.2 R49.1 TP2.1 ; port CMPRSR+
CMPRSR_SW: C81.1 C82.1 C85.2 L12.2 Q7.2(D)
GND: C81.2 C82.2 C83.1 C84.1 C85.1 C90.1 D11.2(K) D14.1(A) L12.1 L21.4 Q8.2(S) Q20.2(S) R40.1 R44.1 R60.1 ; port GND
GND_CMP: C86.1 D10.1(A) L12.4 ; port GND_CMP
C: P1.1 R57.1 R59.2 ; port C
CMPRSR_EN: R41.1 ; port EN
COM_FAN: R9.1 ; port COM_FAN  [project net CMPRSR_FAN]
D_I: R48.1 R49.2 ; port D_I
D_I_3V: D14.2(K) R48.2 ; port D_I_3V  [project net CMPRSR_D_I]
P: R59.1 ; port P
SPD_CTL: R53.1 ; port SPD_CTL  [project net CMPRSR_SPD]
T: Q9.3(D) R57.2 ; port T
NetC84_2: C84.2 F1.2(K) L11.2
NetC87_1: C87.1 R40.2
NetC87_2: C87.2 L10.2 L11.1
NetC88_1: C88.1 Q7.1(G) R39.1 R42.2
NetC90_2: C90.2 Q9.1(G) R53.2 TP11.1
NetC131_1: C131.1 F6.1(A) Q19.2(S) R95.1
NetC131_2: C131.2 Q19.1(G) Q20.3(D) R95.2
NetD11_1: D11.1(A) R43.1
NetL21_1: L21.1 Q19.3(D)
NetP1_2: P1.2 Q9.2(S) R60.2
NetQ8_1: Q8.1(G) R41.2 R44.2 TP7.1
NetQ8_3: Q8.3(D) R42.1
NetQ20_1: Q20.1(G) R9.2

### Layout directives
net class HI_POWER: +10-25V_C_F, CMPRSR+, CMPRSR_SW, NetC87_2

### Notes on the sheet
- COMPRESSOR FAN MONITORING
- COMPRESSOR SPEED/VOLTAGE SETTING
- COMPRESSOR ERROR MONITORING
- RQ3L070BGTB1

### Library data of the parts
C81 C82 = NS00911: as C3 on sheet TopLevel; Part Number: NS00911; Value: 100uF, 35V; Supplier 1: Digi-Key; Supplier Part Number 1: PCE5051CT-ND
C83-C87 C131 = NS00832: as C26 on sheet BatteryCharger; Part Number: NS00832; Value: 10uF, 50V; Supplier 1: Digi-Key; Supplier Part Number 1: 1276-6767-1-ND
C88 = NS00871: as C38 on sheet BatteryCharger; Part Number: NS00871; Value: 1uF, 50V; Supplier 1: Digi-Key; Supplier Part Number 1: 1276-6470-1-ND
C90 = NS00353: 0.10µF ±10% 50V Ceramic Capacitor X7R 0805 (2012 Metric); Type: C; Value: 0.1uF, 50V; Alternatives: Generic; Part Number: NS00353; Supplier 1: Digi-Key; Supplier Part Number 1: 478-1395-1-ND
C132 = NS00838: as C113 on sheet TopLevel; Part Number: NS00838; Value: 0.1uF, 50V; Supplier 1: Digi-Key; Supplier Part Number 1: 1276-1935-1-ND
D10 D27 = NS00891: TVS DIODE 28VWM 45.4VC SMB; Part Number: NS00891; Type: Diode; Value: SMBJ28A-13-F; ComponentLink1Description: Datasheet; ComponentLink1URL: H:\Doc\Diodes\ds19002-2.pdf; Supplier 1: Digi-Key; Supplier Part Number 1: SMBJ28A-FDICT-ND
D11 = NS00945: LED RED CLEAR 1608 SMD; Type: IC; Part Number: NS00945; Value: RED; ComponentLink1Description: Datasheet; ComponentLink1URL: H:\Doc\Harvatek\B1911USD-20D000114U1930.pdf; Supplier 1: Digi-Key; Supplier Part Number 1: 3147-B1911USD-20D000114U1930CT-ND
D14 = NS00914: DIODE ZENER 3V 300MW SOD323; Part Number: NS00914; Type: Diode; Value: MM3Z3V6ST1G; ComponentLink1Description: Datasheet; ComponentLink1URL: H:\Doc\ONsemi\MM3Z2V4ST1-D.PDF; Supplier 1: Digi-Key; Supplier Part Number 1: MM3Z3V0ST1GOSCT-ND
F1 = NS00921: PTC RESET FUSE 32V 10A RADIAL; Alternatives: Generic; Part Number: NS00921; Type: Fuse; Value: 10A, 32V; Supplier 1: Digi-Key; Supplier Part Number 1: 507-0ZRS1000FF1A-ND
F6 = NS00950: PTC RESET FUSE 24V 1.5A 1812; Alternatives: Generic; Part Number: NS00950; Type: Fuse; Value: 1.5A, 24V; Supplier 1: Digi-Key; Supplier Part Number 1: 507-1773-1-ND
L10 L11 = NS00854: FIXED IND 4.7UH 26A 5.5 MOHM SMD; Part Number: NS00854; Type: Inductor; Value: 4.7uH, 26A; ComponentLink1Description: Datasheet; ComponentLink1URL: H:\Doc\Bourns\srp1770c.pdf; Supplier 1: Digi-Key; Supplier Part Number 1: SRP1770C-4R7MCT-ND
L12 = NS00944: CMC 1.8UH 9A 2LN 140 OHM SMD553-4125-1-ND; Type: Inductor; Part Number: NS00944; Value: 140R@100MHz, 9A; ComponentLink1Description: Datasheet; ComponentLink1URL: H:\Doc\Eaton\datasheet_p850_1608182804.pdf; Supplier 1: Digi-Key; Supplier Part Number 1: 553-4125-1-ND
L21 = CHOKE_COMMON_ALT: as L6 on sheet TopLevel; Value: 1.1k@100MHz, 2A; ComponentLink1Description: Datasheet; ComponentLink1URL: H:\Doc\Murata\EFLC0026.pdf; Supplier 1: Digi-Key; Supplier Part Number 1: 490-12641-1-ND
P1 = Header 2: Header, 2-Pin; LatestRevisionDate: 17-Jul-2002; LatestRevisionNote: Re-released for DXP Platform.; Publisher: Altium Limited
Q7 = NS00810: P-CHANNEL MOSFET, DPAK; Type: IC; Part Number: NS00810; Value: MCU45P03A-TP; ComponentLink1Description: Datasheet; ComponentLink1URL: H:\Doc\MicroCommercial\MCU45P03A(DPAK).pdf; Supplier 1: Digi-Key; Supplier Part Number 1: 353-MCU45P03A-TPCT-ND
Q8 Q9 Q20 = NS00873: MOSFET N-CH 60V 210MA SOT23; Type: IC; Published: 8-Jun-2000; LatestRevisionDate: 17-Jul-2002; LatestRevisionNote: Re-released for DXP Platform.; PackageVersion: 1995/1996; PackageReference: E3; Publisher: Altium Limited; Part Number: NS00873; Value: DMN67D8L-7; ComponentLink1Description: Datasheet; ComponentLink1URL: H:\Doc\Diodes\DMN67D8L.pdf; Supplier 1: Digi-Key; Supplier Part Number 1: DMN67D8L-7DICT-ND
Q19 = NS00910: MOSFET P-CH 30V 4.3A SOT23; Type: IC; Part Number: NS00910; Value: DMP3056L-7; ComponentLink1Description: Datasheet; ComponentLink1URL: H:\Doc\Diodes\DMP3056L.pdf; Supplier 1: Digi-Key; Supplier Part Number 1: DMP3056L-7DICT-ND
R9 R41 R42 = CMP-1012-00284-2: Thick Film Chip Resistors 0603 10Ω 0.1W 1% 100ppm/°C; Max Power Dissipation: 100mW; Resistance: 10R; Voltage Rating: 50V; Depth: 0.8mm; REACH SVHC: No SVHC; Package Quantity: 1; Thickness: 457um; Length: 1.6mm; Tolerance: 1%; Width: 0.8mm; Number of Pins: 2; Height: 0.45mm; Military Standard: Not; Features: Moisture Resistant; Packaging: Tape and Reel; Case/Package: 0603; Power Rating: 100mW; Voltage Rating (DC): 50V; Radiation Hardening: No; Mount: Surface Mount; Min Operating Temperature: -55°C; Composition: Thick Film; Max Operating Temperature: 155°C; Termination: SMD/SMT; Temperature Coefficient: 100ppm/°C; Case Code (Imperial): 0603; Case Code (Metric): 1608; Number of Terminations: 2; Contact Plating: Tin
R39 = NS00835: as R19 on sheet BatteryCharger; Part Number: NS00835; Type: R; Value: 100k, 1%, 1/10W; Supplier 1: Digi-Key; Supplier Part Number 1: RMCF0603FT100KCT-ND
R40 = NS00946: as R3 on sheet TopLevel; Part Number: NS00946; Type: R; Value: 2R, 1%, 1/4W; Supplier 1: Digi-Key; Supplier Part Number 1: 738-RMCF1206FT2R00CT-ND
R43 R44 R48 R95 = NS00820: as R4 on sheet TopLevel; Part Number: NS00820; Type: R; Value: 10k, 1%, 1/10W; Supplier 1: Digi-Key; Supplier Part Number 1: RMCF0603FT10K0CT-ND
R49 = NS00820: RES 10K OHM 1% 1/10W 0603; Value: 10k, 1%, 1/10W; Alternatives: Generic; Part Number: NS00820; Type: R; Supplier 1: Digi-Key; Supplier Part Number 1: RMCF0603FT10K0CT-ND
R53 = NS00876: RES 0 OHM JUMPER 1/10W 0603; Alternatives: Generic; Part Number: NS00876; Type: R; Value: 0R, 1/10W; Supplier 1: Digi-Key; Supplier Part Number 1: RMCF0603ZT0R00CT-ND
R57 = NS00951: RES 1.5K OHM 1% 1/10W 0603; Alternatives: Generic; Part Number: NS00951; Type: R; Value: 1.5k, 1%, 1/10W; Supplier 1: Digi-Key; Supplier Part Number 1: 311-1.50KHRTR-ND
R59 = NS00915: RES SMD 100K OHM 1% 1/10W 0603; Alternatives: Generic; Part Number: NS00915; Type: R; Value: 100k, 1%, 1/10W; Supplier 1: Digi-Key; Supplier Part Number 1: YAG3579CT-ND
R60 = NS00876: RES 300kOHM JUMPER 1/10W 0603; Value: 300k, 1/10W; Alternatives: Generic; Part Number: NS00876; Type: R; Supplier 1: Digi-Key; Supplier Part Number 1: RMCF0603ZT0R00CT-ND
TP2 TP7 TP10 TP11 = Test Point: Test Point 0.3mm; PartType: Mechanical; ComponentLink1Description: Datasheet

## Sheet Power.SchDoc
size A3; SheetNumber: 4; SheetTotal: 5
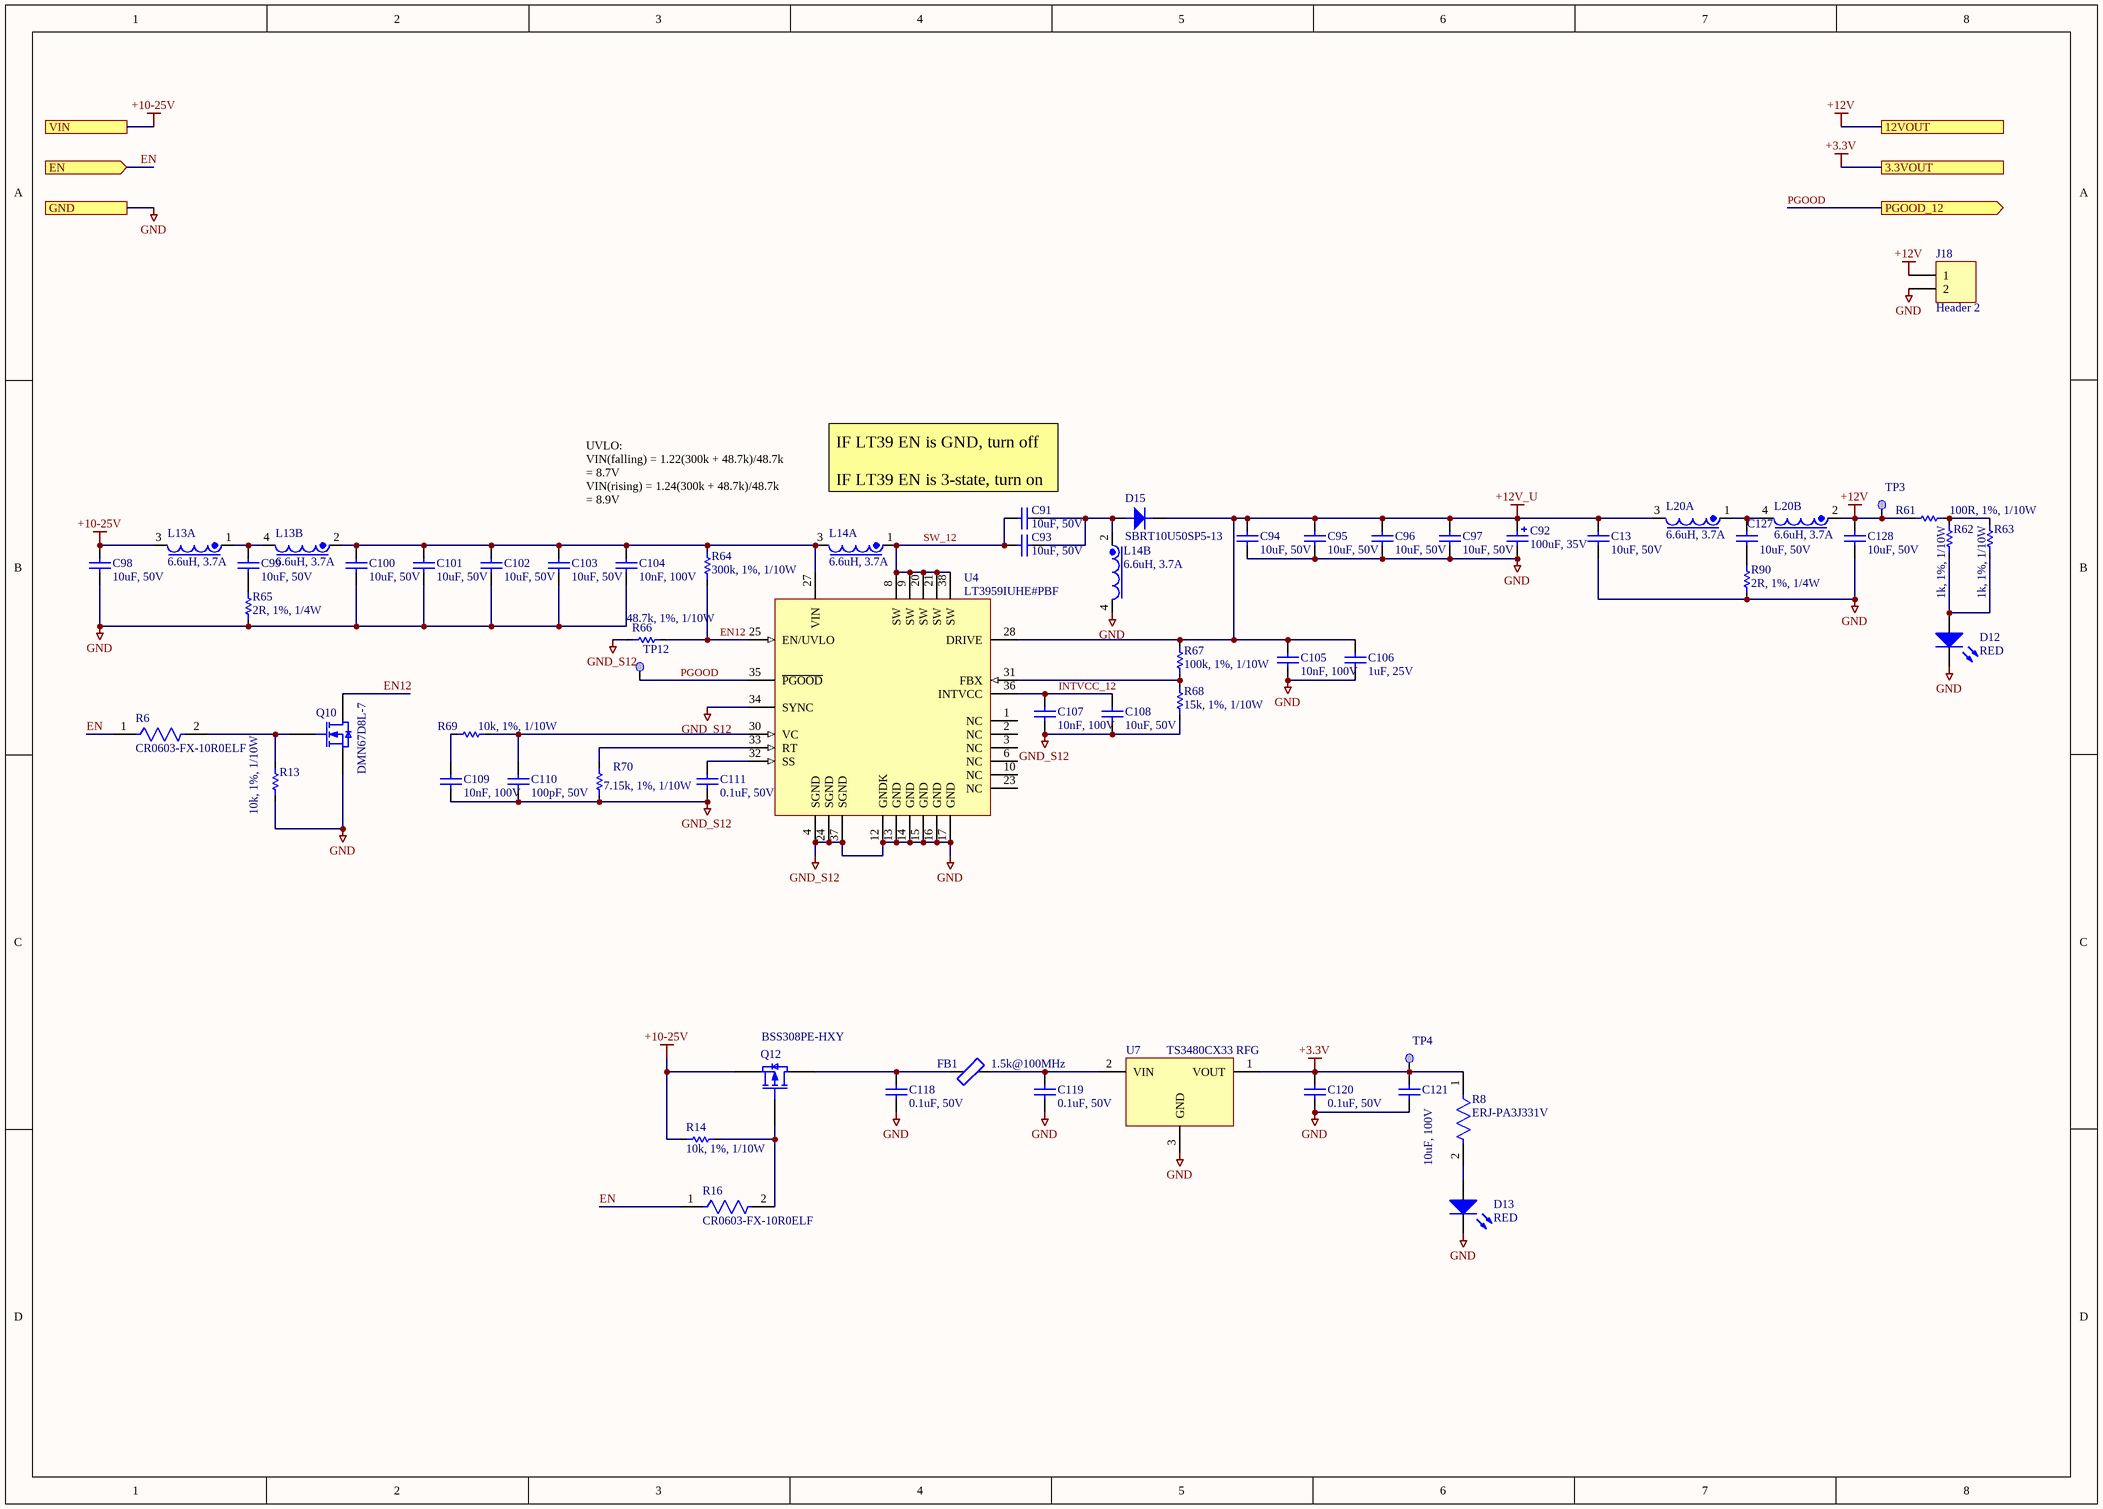
[diagram p3: Power.SchDoc]

### Parts
C13  10uF, 50V  [1206]
C91  10uF, 50V  [1206]
C92  100uF, 35V  [CAPAE7866X80L]
C93  10uF, 50V  [1206]
C94  10uF, 50V  [1206]
C95  10uF, 50V  [1206]
C96  10uF, 50V  [1206]
C97  10uF, 50V  [1206]
C98  10uF, 50V  [1206]
C99  10uF, 50V  [1206]
C100  10uF, 50V  [1206]
C101  10uF, 50V  [1206]
C102  10uF, 50V  [1206]
C103  10uF, 50V  [1206]
C104  10nF, 100V  [0603]
C105  10nF, 100V  [0603]
C106  1uF, 25V  [0603]
C107  10nF, 100V  [0603]
C108  10uF, 50V  [1206]
C109  10nF, 100V  [0603]
C110  100pF, 50V  [0603]
C111  0.1uF, 50V  [0603]
C118  0.1uF, 50V  [0603]
C119  0.1uF, 50V  [0603]
C120  0.1uF, 50V  [0603]
C121  10uF, 100V  [1210]
C127  10uF, 50V  [1206]
C128  10uF, 50V  [1206]
D12  RED  [0603_DIODE_K1A2]
D13  RED  [0603_DIODE_K1A2]
D15  SBRT10U50SP5-13  [DPAK184P650X115-3L]
FB1  1.5k@100MHz  [0805]
J18  Header 2  [CONN-TH_2P-P2.50_HX25003-2A]
L13  6.6uH, 3.7A  [PLCC300P1250X1250X600-4N]  (parts A,B of 2)
L14  6.6uH, 3.7A  [PLCC300P1250X1250X600-4N]  (parts A,B of 2)
L20  6.6uH, 3.7A  [PLCC300P1250X1250X600-4N]  (parts A,B of 2)
Q10  DMN67D8L-7  [SOT23-3]
Q12  BSS308PE-HXY  [SOT23-3]
R6  CR0603-FX-10R0ELF  [FP-CR0603-MFG]
R8  ERJ-PA3J331V  [FP-ERJPA3-MFG]
R13  10k, 1%, 1/10W  [0603]
R14  10k, 1%, 1/10W  [0603]
R16  CR0603-FX-10R0ELF  [FP-CR0603-MFG]
R61  100R, 1%, 1/10W  [0603]
R62  1k, 1%, 1/10W  [0603]
R63  1k, 1%, 1/10W  [0603]
R64  300k, 1%, 1/10W  [0603]
R65  2R, 1%, 1/4W  [1206]
R66  48.7k, 1%, 1/10W  [0603]
R67  100k, 1%, 1/10W  [0603]
R68  15k, 1%, 1/10W  [0603]
R69  10k, 1%, 1/10W  [0603]
R70  7.15k, 1%, 1/10W  [0603]
R90  2R, 1%, 1/4W  [1206]
TP3  Test Point  [TEST POINT 40 Mil]  (value not drawn)  (no BOM)
TP4  Test Point  [TEST POINT 40 Mil]  (value not drawn)  (no BOM)
TP12  Test Point  [TEST POINT 40 Mil]  (value not drawn)  (no BOM)
U4  LT3959IUHE#PBF  [QFN50P500X600X80_LT_UHEMA]
U7  TS3480CX33 RFG  [SOT23-3]

### Ports
3.3VOUT, 12VOUT, EN (in), GND, PGOOD_12 (out), VIN

### Nets
+3.3V: C120.1 C121.2 R8.1 TP4.1 U7.1(VOUT) ; port 3.3VOUT
+10-25V: C98.2 L13.3 Q12.3(S) R14.1 ; port VIN
+12V: C128.2 J18.1 L20.2 R61.2 TP3.1 ; port 12VOUT
+12V_U: C13.2 C92.1 C94.2 C95.2 C96.2 C97.2 C105.2 C106.2 D15.2(K) L20.3 R67.2 U4.28(DRIVE)
GND: C13.1 C92.2 C94.1 C95.1 C96.1 C97.1 C98.1 C100.1 C101.1 C102.1 C103.1 C104.1 C105.1 C106.1 C107.1 C108.1 C109.1 C110.1 C111.2 C118.2 C119.2 C120.2 C121.1 C128.1 D12.2(K) D13.2(K) J18.2 L14.4 Q10.2(S) R13.2 R65.1 R66.2 R68.1 R70.1 R90.1 U4.4(SGND) U4.12(GNDK) U4.13(GND) U4.14(GND) U4.15(GND) U4.16(GND) U4.17(GND) U4.24(SGND) U4.34(SYNC) U4.37(SGND) U7.3(GND) ; port GND  [also labelled GND_S12]
EN: R6.1 R16.1 ; port EN
EN12: Q10.3(D) R64.1 R66.1 U4.25(EN/UVLO)
INTVCC_12: C107.2 C108.2 U4.36(INTVCC)
PGOOD: TP12.1 U4.35(~{PGOOD}) ; port PGOOD_12
SW_12: C91.1 C93.1 L14.1 U4.8(SW) U4.9(SW) U4.20(SW) U4.21(SW) U4.38(SW)
NetC91_2: C91.2 C93.2 D15.1(A) L14.2
NetC99_1: C99.1 R65.2
NetC99_2: C99.2 L13.1 L13.4
NetC100_2: C100.2 C101.2 C102.2 C103.2 C104.2 L13.2 L14.3 R64.2 U4.27(VIN)
NetC109_2: C109.2 R69.2
NetC110_2: C110.2 R69.1 U4.30(VC)
NetC111_1: C111.1 U4.32(SS)
NetC118_1: C118.1 FB1.1 Q12.2(D)
NetC119_1: C119.1 FB1.2 U7.2(VIN)
NetC127_1: C127.1 R90.2
NetC127_2: C127.2 L20.1 L20.4
NetD12_1: D12.1(A) R62.2 R63.2
NetD13_1: D13.1(A) R8.2
NetQ10_1: Q10.1(G) R6.2 R13.1
NetQ12_1: Q12.1(G) R14.2 R16.2
NetR61_1: R61.1 R62.1 R63.1
NetR67_1: R67.1 R68.2 U4.31(FBX)
NetR70_2: R70.2 U4.33(RT)

Not connected (* = marked no-connect by the designer): U4 1(NC) 2(NC) 3(NC) 6(NC) 10(NC) 23(NC)

### Notes on the sheet
- (near C91) IF LT39 EN is GND, turn off
  IF LT39 EN is 3-state, turn on
- UVLO:
  VIN(falling) = 1.22(300k + 48.7k)/48.7k
  = 8.7V
  VIN(rising) = 1.24(300k + 48.7k)/48.7k
  = 8.9V

### Library data of the parts
C13 C91 C93-C103 C108 C127 C128 = NS00832: as C26 on sheet BatteryCharger; Part Number: NS00832; Value: 10uF, 50V; Supplier 1: Digi-Key; Supplier Part Number 1: 1276-6767-1-ND
C92 = NS00911: as C3 on sheet TopLevel; Part Number: NS00911; Value: 100uF, 35V; Supplier 1: Digi-Key; Supplier Part Number 1: PCE5051CT-ND
C104 C105 C107 C109 = NS00848: as C39 on sheet BatteryCharger; Part Number: NS00848; Value: 10nF, 100V; Supplier 1: Digi-Key; Supplier Part Number 1: 445-172665-1-ND
C106 = NS00836: CAP CER 1UF 25V X7R 0603; Type: C; Alternatives: Generic; Part Number: NS00836; Value: 1uF, 25V; Supplier 1: Digi-Key; Supplier Part Number 1: 1276-1184-1-ND
C110 = NS00840: as C71 on sheet BatteryCharger; Part Number: NS00840; Value: 100pF, 50V; Supplier 1: Digi-Key; Supplier Part Number 1: 478-1175-1-ND
C111 C118-C120 = NS00838: as C113 on sheet TopLevel; Part Number: NS00838; Value: 0.1uF, 50V; Supplier 1: Digi-Key; Supplier Part Number 1: 1276-1935-1-ND
C121 = NS00779: as C1 on sheet TopLevel; Part Number: NS00779; Value: 10uF, 100V; Supplier 1: Digi-Key; Supplier Part Number 1: 1276-CL32Y106KCVZNWECT-ND
D12 D13 = NS00945: LED RED CLEAR 1608 SMD; Type: IC; Part Number: NS00945; Value: RED; ComponentLink1Description: Datasheet; ComponentLink1URL: H:\Doc\Harvatek\B1911USD-20D000114U1930.pdf; Supplier 1: Digi-Key; Supplier Part Number 1: 3147-B1911USD-20D000114U1930CT-ND
D15 = NS00833: DIODE SBR 50V 10A POWERDI5; Part Number: NS00833; Type: Diode; Value: SBRT10U50SP5-13; ComponentLink1Description: Datasheet; ComponentLink1URL: H:\Doc\Diodes\SBRT10U50SP5.pdf; Supplier 1: Digi-Key; Supplier Part Number 1: SBR10E45P5-7DICT-ND
FB1 = NS00881: WE-CBA SMT EMI SUPPRESSION FERRITE; Type: Inductor; Part Number: NS00881; Value: 1.5k@100MHz; ComponentLink1Description: Datasheet; ComponentLink1URL: H:\Doc\Wurth\782853162.pdf; Supplier 1: Digi-Key; Supplier Part Number 1: 732-782853162CT-ND
J18 = Header 2: Header, 2-Pin; LatestRevisionDate: 17-Jul-2002; LatestRevisionNote: Re-released for DXP Platform.; Publisher: Altium Limited; Supplier 1: Digi-Key; Supplier Part Number 1: 455-B2B-XH-A-ND
L13 L14 L20 = NS00831: INDUCT ARRAY 2 COIL 6.6UH SMD; Type: Inductor; Part Number: NS00831; Value: 6.6uH, 3.7A; ComponentLink1Description: Datasheet; ComponentLink1URL: H:\Doc\pulse\SPM2007_28.pdf; Supplier 1: Digi-Key; Supplier Part Number 1: 553-3631-ND
Q10 = NS00873: MOSFET N-CH 60V 210MA SOT23; Type: IC; Published: 8-Jun-2000; LatestRevisionDate: 17-Jul-2002; LatestRevisionNote: Re-released for DXP Platform.; PackageVersion: 1995/1996; PackageReference: E3; Publisher: Altium Limited; Part Number: NS00873; Value: DMN67D8L-7; ComponentLink1Description: Datasheet; ComponentLink1URL: H:\Doc\Diodes\DMN67D8L.pdf; Supplier 1: Digi-Key; Supplier Part Number 1: DMN67D8L-7DICT-ND
Q12 = NS00810: P-CHANNEL MOSFET; Type: IC; Part Number: NS00810; Value: BSS308PE-HXY; ComponentLink1Description: Datasheet; ComponentLink1URL: H:\Doc\MicroCommercial\MCU45P03A(DPAK).pdf; Supplier 1: Digi-Key; Supplier Part Number 1: 353-MCU45P03A-TPCT-ND
R6 R16 = CMP-1012-00284-2: as R9 on sheet CompressorIface; Depth: 0.8mm; REACH SVHC: No SVHC; Package Quantity: 1; Thickness: 457um; Length: 1.6mm; Tolerance: 1%; Width: 0.8mm; Number of Pins: 2; Height: 0.45mm; Military Standard: Not; Features: Moisture Resistant; Packaging: Tape and Reel; Case/Package: 0603; Power Rating: 100mW; Voltage Rating (DC): 50V; Radiation Hardening: No; Mount: Surface Mount; Min Operating Temperature: -55°C; Composition: Thick Film; Max Operating Temperature: 155°C; Termination: SMD/SMT; Temperature Coefficient: 100ppm/°C; Case Code (Imperial): 0603; Case Code (Metric): 1608; Number of Terminations: 2; Contact Plating: Tin
R8 = CMP-05422-000096-1: as R51 on sheet BatteryCharger; Case Code (Imperial): 0603; Height: 0.018inch; Case/Package: 0603; Case Code (Metric): 1608; Width: 0.031inch; Length: 0.063inch; Tolerance: 5%; Features: Automotive AEC-Q200; Min Operating Temperature: -55°C; Max Operating Temperature: 155°C; Resistor Type: Thick Film; Packaging: Cut Tape; Number of Terminations: 2; Parameter 1: *; Parameter 2: *
R13 R14 R69 = NS00820: as R4 on sheet TopLevel; Part Number: NS00820; Type: R; Value: 10k, 1%, 1/10W; Supplier 1: Digi-Key; Supplier Part Number 1: RMCF0603FT10K0CT-ND
R61 = NS00870: RES 100 OHM 1% 1/10W 0603; Alternatives: Generic; Part Number: NS00870; Type: R; Value: 100R, 1%, 1/10W; Supplier 1: Digi-Key; Supplier Part Number 1: RMCF0603FT100RCT-ND
R62 R63 = NS00882: as R1 on sheet TopLevel; Part Number: NS00882; Type: R; Value: 1k, 1%, 1/10W; Supplier 1: Digi-Key; Supplier Part Number 1: RMCF0603FT1K00CT-ND
R64 = NS00837: as R30 on sheet BatteryCharger; Part Number: NS00837; Type: R; Value: 300k, 1%, 1/10W; Supplier 1: Digi-Key; Supplier Part Number 1: RMCF0603FT300KCT-ND
R65 R90 = NS00946: as R3 on sheet TopLevel; Part Number: NS00946; Type: R; Value: 2R, 1%, 1/4W; Supplier 1: Digi-Key; Supplier Part Number 1: 738-RMCF1206FT2R00CT-ND
R66 = NS00826: RES 48.7K OHM 1% 1/10W 0603; Alternatives: Generic; Part Number: NS00826; Type: R; Value: 48.7k, 1%, 1/10W; Supplier 1: Digi-Key; Supplier Part Number 1: RMCF0603FT48K7CT-ND
R67 = NS00835: as R19 on sheet BatteryCharger; Part Number: NS00835; Type: R; Value: 100k, 1%, 1/10W; Supplier 1: Digi-Key; Supplier Part Number 1: RMCF0603FT100KCT-ND
R68 = NS00834: as R37 on sheet BatteryCharger; Part Number: NS00834; Type: R; Value: 15k, 1%, 1/10W; Supplier 1: Digi-Key; Supplier Part Number 1: 1292-WR06X1502FTLCT-ND
R70 = NS00839: RES 7.15K OHM 1% 1/10W 0603; Alternatives: Generic; Part Number: NS00839; Type: R; Value: 7.15k, 1%, 1/10W; Supplier 1: Digi-Key; Supplier Part Number 1: RMCF0603FT7K15CT-ND
TP3 TP4 TP12 = Test Point: Test Point 0.3mm; PartType: Mechanical; ComponentLink1Description: Datasheet
U4 = NS00829: IC REG MULTI CONFG ADJ 6A 36QFN; Part Number: NS00829; Type: IC; Value: LT3959IUHE#PBF; ComponentLink1Description: Datasheet; ComponentLink1URL: H:\Doc\Linear_Technologies\3959fa.pdf; Supplier 1: Digi-Key; Supplier Part Number 1: 505-LT3959IUHE#PBF-ND
U7 = NS00929: IC REG LINEAR 3.3V 100MA SOT23; Part Number: NS00929; Type: IC; Value: TS3480CX33 RFG; ComponentLink1Description: Datasheet; ComponentLink1URL: H:\Doc\TaiwanSemi\TS3480.pdf; Supplier 1: Digi-Key; Supplier Part Number 1: TS3480CX33RFGCT-ND